# EAGLE design RedBoard-Artemis (EAGLE 9.4.2)
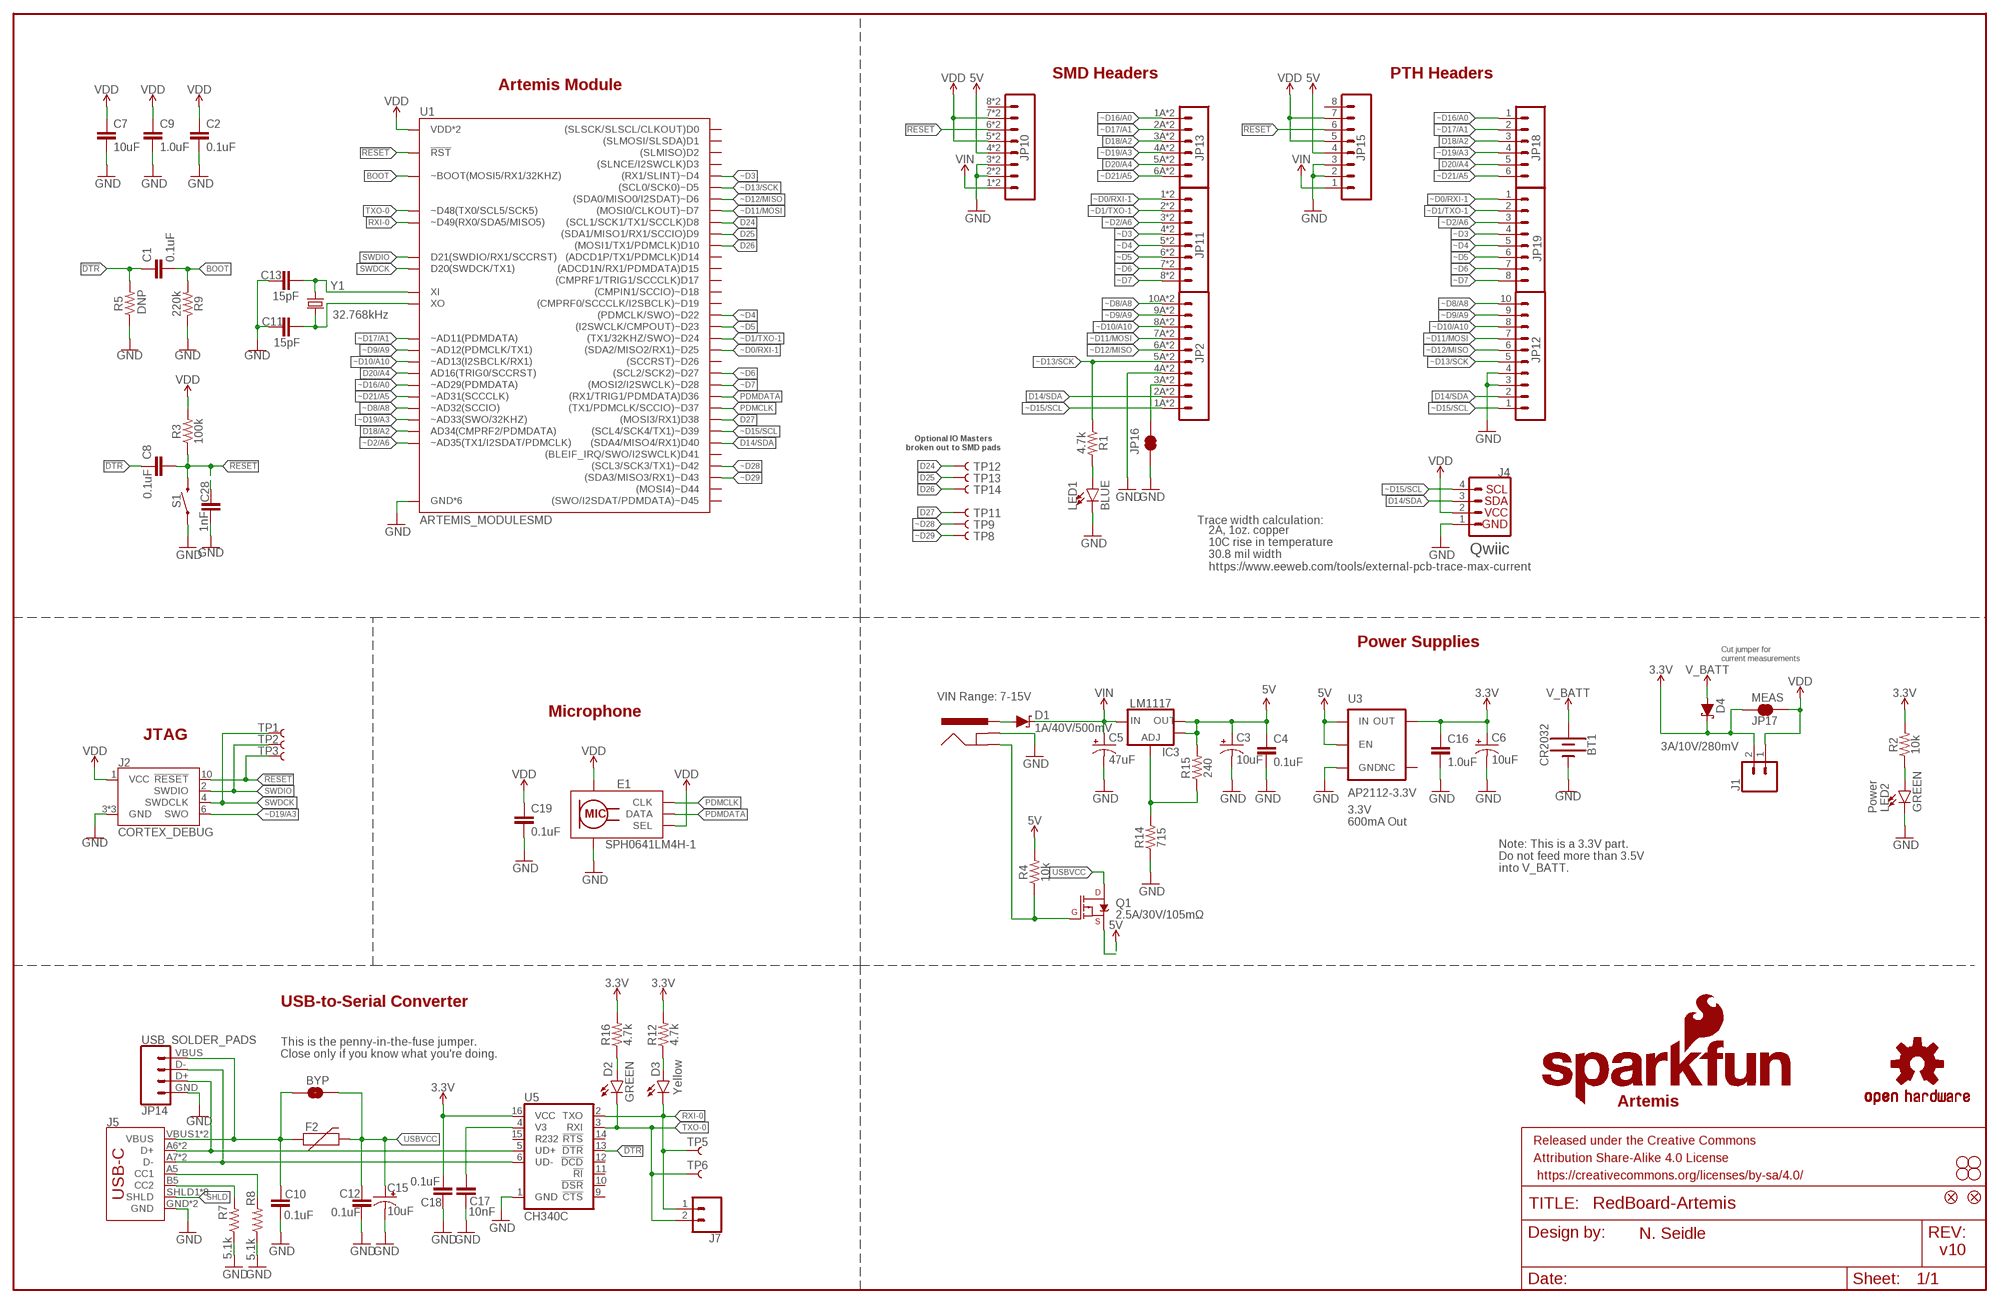
[diagram p0: schematic, sheet 1]

## Parts
BT1  CR2032  BATTERY-20MM_SMD_4LEGS_OVERPASTE  [BATTCON_20MM_4LEGS_OVERPASTE]
BYP  JUMPER-SMT_2_NO_SILK  [SMT-JUMPER_2_NO_SILK]
C1  0.1uF  0.1UF-0603-25V-5%  [0603]
C2  0.1uF  0.1UF-0603-25V-(+80/-20%)  [0603]
C3  10uF  10UF-POLAR-EIA3216-16V-10%(TANT)  [EIA3216]
C4  0.1uF  0.1UF-0603-25V-(+80/-20%)  [0603]
C5  47uF  47UF-POLAR-PANASONIC_D-35V-20%  [PANASONIC_D]
C6  10uF  10UF-POLAR-EIA3216-16V-10%(TANT)  [EIA3216]
C7  10uF  10UF-0603-6.3V-20%  [0603]
C8  0.1uF  0.1UF-0603-25V-5%  [0603]
C9  1.0uF  1.0UF-0603-16V-10%  [0603]
C10  0.1uF  0.1UF-0603-25V-(+80/-20%)  [0603]
C11  15pF  15PF-0603-50V-5%  [0603]
C12  0.1uF  0.1UF-0603-25V-(+80/-20%)  [0603]
C13  15pF  15PF-0603-50V-5%  [0603]
C15  10uF  10UF-POLAR-EIA3216-16V-10%(TANT)  [EIA3216]
C16  1.0uF  1.0UF-0603-16V-10%  [0603]
C17  10nF  10NF-0603-50V-10%  [0603]
C18  0.1uF  0.1UF-0603-25V-(+80/-20%)  [0603]
C19  0.1uF  0.1UF-0603-25V-(+80/-20%)  [0603]
C28  1nF  1.0NF/1000PF-0603-50V-10%  [0603]
D1  1A/40V/500mV  DIODE-SCHOTTKY-SS14  [SMA-DIODE]
D2  GREEN  LED-GREENLILYPAD  [LED-1206]
D3  Yellow  LED-YELLOWLILYPAD  [LED-1206]
D4  3A/10V/280mV  DIODE-SCHOTTKY-BAT60A  [SOD-323]
E1  SPH0641LM4H-1  SPH0641LM4H-1_MICROPHONE  [SPH0641LM4H-1_MICROPHONE]
F2  6V/2A  PPTC_6V2A  [1210]
FRAME3  FRAME-LEDGER  [CREATIVE_COMMONS]
IC3  LM1117  V_REG_LM1117ALT1  [SOT223-ALT1]
J1  CONN_021X02_NO_SILK  [1X02_NO_SILK]
J2  CORTEX_DEBUG  CORTEX_DEBUG_MINIMUM_PTH_NS  [2X5-PTH-1.27MM-NO_SILK]
J3  POWER_JACKTOE  [POWER_JACK_SMD_OVERPASTE_TOE]
J4  QWIIC_CONNECTORJS-1MM  [JST04_1MM_RA]
J5  USB-C  USB_C2-LAYER  [USB-C-16P]
J7  CONN_021X02_NO_SILK  [1X02_NO_SILK]
JP1  SFE_LOGO_NAME.1_INCH  [SFE_LOGO_NAME_.1]
JP2  M10SMD_COMBO  [1X10_SMD_COMBINED]
JP3  STAND-OFF  [STAND-OFF]
JP4  STAND-OFF  [STAND-OFF]
JP5  STAND-OFF  [STAND-OFF]
JP6  STAND-OFF  [STAND-OFF]
JP7  SFE_LOGO_FLAME.1_INCH  [SFE_LOGO_FLAME_.1]
JP8  FIDUCIAL1X2  [FIDUCIAL-1X2]
JP9  FIDUCIAL1X2  [FIDUCIAL-1X2]
JP10  CONN_08SMD-COMBO-FEMALE_NC  [1X08_SMD_COMBINED_NC]
JP11  JP11  CONN_08SMD-COMBO-FEMALE_NC  [1X08_SMD_COMBINED_NC]
JP12  M10NO_SILK  [1X10_NO_SILK]
JP13  M06SMD-STRAIGHT-COMBO  [1X06_SMD_STRAIGHT_COMBO]
JP14  USB_SOLDER_PADS  [USB-SOLDER-PADS]
JP15  M08NO_SILK  [1X08_NO_SILK@1]
JP16  JUMPER-SMT_2_NC_TRACE_SILK  [SMT-JUMPER_2_NC_TRACE_SILK]
JP17  MEAS  JUMPER-SMT_2_NC_TRACE_SILK  [SMT-JUMPER_2_NC_TRACE_SILK]
JP18  M06NO_SILK  [1X06_NO_SILK@1]
JP19  CONN_08NO_SILK_FEMALE_PTH  [1X08_NO_SILK]
LED1  BLUE  LED-BLUE1206  [LED-1206]
LED2  GREEN  LED-GREENLILYPAD  [LED-1206]
Q1  2.5A/30V/105mΩ  MOSFET_PCH-DMG2307L  [SOT23-3]
R1  4.7k  4.7KOHM-0603-1/10W-1%  [0603]
R2  10k  10KOHM-0603-1/10W-1%  [0603]
R3  100k  100KOHM-0603-1/10W-1%  [0603]
R4  10k  10KOHM-0603-1/10W-1%  [0603]
R5  RESISTOR0603  [0603]
R7  5.1k  5.1KOHM5.1KOHM-0603-1/10W-1%  [0603]
R8  5.1k  5.1KOHM5.1KOHM-0603-1/10W-1%  [0603]
R9  220k  220KOHM-0603-1/10W-1%  [0603]
R12  4.7k  4.7KOHM-0603-1/10W-1%  [0603]
R14  715  715OHM-0603-1/10W-1%  [0603]
R15  240  240OHM-0603-1/10W-1%  [0603]
R16  4.7k  4.7KOHM-0603-1/10W-1%  [0603]
S1  MOMENTARY-SWITCH-SPST-SMD-5.2-TALL-REDUNDANT  [TACTILE_SWITCH_SMD_5.2MM]
TP1  TEST-POINT3X5  [PAD.03X.05]
TP2  TEST-POINT3X5  [PAD.03X.05]
TP3  TEST-POINT3X5  [PAD.03X.05]
TP5  TEST-POINT3X5  [PAD.03X.05]
TP6  TEST-POINT3X5  [PAD.03X.05]
TP8  TEST-POINT3X5  [PAD.03X.05]
TP9  TEST-POINT3X5  [PAD.03X.05]
TP11  TEST-POINT3X5  [PAD.03X.05]
TP12  TEST-POINT3X5  [PAD.03X.05]
TP13  TEST-POINT3X5  [PAD.03X.05]
TP14  TEST-POINT3X5  [PAD.03X.05]
U1  ARTEMIS_MODULESMD  [ARTEMIS_FP]
U3  AP2112-3.3V  V_REG_AP2112K-3.3V  [SOT23-5]
U5  CH340C  [SO016]
U$16  OSHW-LOGOS  [OSHW-LOGO-S]
Y1  32.768kHz  CRYSTAL-32.768KHZSMD-3.2X1.5  [CRYSTAL-SMD-3.2X1.5MM]

## Nets
3.3V: C6.+ C16.1 C18.1 D4.C J1.2 JP17.1 R2.2 R12.2 R16.2 U3.5(OUT) U5.16(VCC)
5V [power]: C3.+ C4.1 IC3.2(OUT) IC3.4(OUT) JP10.4 JP10.4@2 JP15.4 Q1.2(S) R4.2 R15.2 U3.1(IN) U3.3(EN)
!DTR: C1.1 C8.1 R5.2 U5.13(!DTR)
!RESET: C8.2 C28.1 J2.10(!RESET) JP10.6 JP10.6@2 JP15.6 R3.1 S1.3 S1.4 TP3.P$1 U1.~RST(!RST)
BOOT: C1.2 R9.2 U1.BOOT(~BOOT(MOSI5/RX1/32KHZ))
CC1: J5.A5(CC1) R8.2
CC2: J5.B5(CC2) R7.2
D14/SDA: J4.3 JP2.2A JP2.2B JP12.2 U1.D40((SDA4/MISO4/RX1)D40)
D18/A2: JP13.3A JP13.3B JP18.3 U1.AD34(AD34(CMPRF2/PDMDATA))
D20/A4: JP13.5A JP13.5B JP18.5 U1.AD16(AD16(TRIG0/SCCRST))
D24: TP12.P$1 U1.D8((SCL1/SCK1/TX1/SCCLK)D8)
D25: TP13.P$1 U1.D9((SDA1/MISO1/RX1/SCCIO)D9)
D26: TP14.P$1 U1.D10((MOSI1/TX1/PDMCLK)D10)
D27: TP11.P$1 U1.D38((MOSI3/RX1)D38)
D+: J5.A6(D+) J5.B6(D+) JP14.D+ U5.5(UD+)
D-: J5.A7(D-) J5.B7(D-) JP14.D- U5.6(UD-)
GND: BT1.2(-) C2.1 C3.- C4.2 C5.- C6.- C7.2 C9.2 C10.2 C11.1 C12.2 C13.1 C15.- C16.2 C17.2 C18.2 C19.2 C28.2 E1.3(GND) E1.6(GND) E1.7(GND) E1.8(GND) J2.3(GND) J2.5(GND) J2.9(GND) J3.GND(GNDBREAK) J4.1 J5.GND J5.GND2(GND) JP2.4A JP2.4B JP10.2 JP10.2@2 JP10.3 JP10.3@2 JP12.3 JP12.4 JP14.GND JP15.2 JP15.3 JP16.1 LED1.C LED2.C R5.1 R7.1 R8.1 R9.1 R14.1 S1.1 S1.2 U1.GND@1(GND*6) U1.GND@22(GND*6) U1.GND@38(GND*6) U1.GND@39(GND*6) U1.GND@47(GND*6) U1.GND@59(GND*6) U3.2(GND) U5.1(GND)
INSERT: J3.P$4(GND) Q1.1(G) R4.1
N$1: LED1.A R1.2
N$2: LED2.A R2.1
N$5: D2.A R16.1
N$6: C17.1 U5.4(V3)
N$7: C11.2 U1.XO Y1.P$2
N$8: C13.2 U1.XI Y1.P$1
N$9: D3.A R12.1
N$10: JP2.3A JP2.3B JP16.2
N$15: IC3.1(ADJ) R14.2 R15.1
PDMCLK: E1.4(CLK) U1.~D37((TX1/PDMCLK/SCCIO)~D37)
PDMDATA: E1.1(DATA) U1.D36((RX1/TRIG1/PDMDATA)D36)
PWRIN [power]: D1.A J3.VIN0(PWR)
RXI-0: D3.C J7.1 TP5.P$1 U1.RXI-0(~D49(RX0/SDA5/MISO5)) U5.2(TXO)
SHLD: J5.SHLD1(SHLD) J5.SHLD2(SHLD) J5.SHLD3(SHLD) J5.SHLD4(SHLD) J5.SHLD5(SHLD) J5.SHLD6(SHLD) J5.SHLD7(SHLD) J5.SHLD8(SHLD)
SWDCK: J2.4(SWDCLK) TP1.P$1 U1.SWDCK(D20(SWDCK/TX1))
SWDIO: J2.2(SWDIO) TP2.P$1 U1.SWDIO(D21(SWDIO/RX1/SCCRST))
TXO-0: D2.C J7.2 TP6.P$1 U1.TXO-0(~D48(TX0/SCL5/SCK5)) U5.3(RXI)
USBVCC [power]: BYP.2 C12.1 C15.+ F2.2 Q1.3(D)
V_BATT: BT1.1(+) D4.A
VDD: C2.2 C7.1 C9.1 C19.1 E1.2(SEL) E1.5(VDD) J1.1 J2.1(VCC) J4.2 JP10.5 JP10.5@2 JP10.7 JP10.7@2 JP15.5 JP15.7 JP17.2 R3.2 U1.VDD@36(VDD*2) U1.VDD@37(VDD*2)
VIN [power]: C5.+ D1.C IC3.3(IN) JP10.1 JP10.1@2 JP15.1
VUSB [power]: BYP.1 C10.1 F2.1 J5.VBUS1(VBUS) J5.VBUS2(VBUS) JP14.VBUS
~D0/RXI-1: JP11.1 JP11.1@2 JP19.1 U1.~D25((SDA2/MISO2/RX1)~D25)
~D1/TXO-1: JP11.2 JP11.2@2 JP19.2 U1.~D24((TX1/32KHZ/SWO)~D24)
~D2/A6: JP11.3 JP11.3@2 JP19.3 U1.~AD35(~AD35(TX1/I2SDAT/PDMCLK))
~D3: JP11.4 JP11.4@2 JP19.4 U1.~D4((RX1/SLINT)~D4)
~D4: JP11.5 JP11.5@2 JP19.5 U1.~D22((PDMCLK/SWO)~D22)
~D5: JP11.6 JP11.6@2 JP19.6 U1.~D23((I2SWCLK/CMPOUT)~D23)
~D6: JP11.7 JP11.7@2 JP19.7 U1.~D27((SCL2/SCK2)~D27)
~D7: JP11.8 JP11.8@2 JP19.8 U1.~D28((MOSI2/I2SWCLK)~D28)
~D8/A8: JP2.10A JP2.10B JP12.10 U1.~AD32(~AD32(SCCIO))
~D9/A9: JP2.9A JP2.9B JP12.9 U1.~AD12(~AD12(PDMCLK/TX1))
~D10/A10: JP2.8A JP2.8B JP12.8 U1.~AD13(~AD13(I2SBCLK/RX1))
~D11/MOSI: JP2.7A JP2.7B JP12.7 U1.D7((MOSI0/CLKOUT)~D7)
~D12/MISO: JP2.6A JP2.6B JP12.6 U1.~D6((SDA0/MISO0/I2SDAT)~D6)
~D13/SCK: JP2.5A JP2.5B JP12.5 R1.1 U1.~D5((SCL0/SCK0)~D5)
~D15/SCL: J4.4 JP2.1A JP2.1B JP12.1 U1.~D39((SCL4/SCK4/TX1)~D39)
~D16/A0: JP13.1A JP13.1B JP18.1 U1.~AD29(~AD29(PDMDATA))
~D17/A1: JP13.2A JP13.2B JP18.2 U1.~AD11(~AD11(PDMDATA))
~D19/A3: J2.6(SWO) JP13.4A JP13.4B JP18.4 U1.~AD33/SWO(~AD33(SWO/32KHZ))
~D21/A5: JP13.6A JP13.6B JP18.6 U1.~AD31(~AD31(SCCCLK))
~D28: TP9.P$1 U1.~D42((SCL3/SCK3/TX1)~D42)
~D29: TP8.P$1 U1.~D43((SDA3/MISO3/RX1)~D43)
Unconnected: JP10.8 JP10.8@2 JP15.8 U1.D0((SLSCK/SLSCL/CLKOUT)D0) U1.D1((SLMOSI/SLSDA)D1) U1.D2((SLMISO)D2) U1.D3((SLNCE/I2SWCLK)D3) U1.D14((ADCD1P/TX1/PDMCLK)D14) U1.D15((ADCD1N/RX1/PDMDATA)D15) U1.D17((CMPRF1/TRIG1/SCCCLK)D17) U1.D41((BLEIF_IRQ/SWO/I2SWCLK)D41) U1.~D18((CMPIN1/SCCIO)~D18) U1.~D19((CMPRF0/SCCCLK/I2SBCLK)~D19) U1.~D26((SCCRST)~D26) U1.~D44((MOSI4)~D44) U1.~D45((SWO/I2SDAT/PDMDATA)~D45) U3.4(NC) U5.9(!CTS) U5.10(!DSR) U5.11(!RI) U5.12(!DCD) U5.14(!RTS) U5.15(R232)

## Notes on the sheet
- SMD Headers | PTH Headers
- Artemis Module
- DNP
- Optional IO Masters
  broken out to SMD pads
- Trace width calculation:
- Qwiic
- 2A, 1oz. copper
  10C rise in temperature
  30.8 mil width
  https://www.eeweb.com/tools/external-pcb-trace-max-current
- Power Supplies
- Cut jumper for
  current measurements
- VIN Range: 7-15V
- Microphone
- JTAG
- Power
- 3.3V
  600mA Out
- Note: This is a 3.3V part.
  Do not feed more than 3.5V
  into V_BATT.
- USB-to-Serial Converter
- This is the penny-in-the-fuse jumper.
  Close only if you know what you're doing.
- Artemis
- N. Seidle
- v10

## Library data of the parts
BT1 = SparkFun-Batteries:BATTERY: Battery - Single Cell A variety of battery chemistries, sizes, and footprints. Device List: 20MM_PTH - Coin Cell Battery Holder - 20mm (PTH) <https://www.sparkfun.com/products/783> 20MM_PTH_KIT- Coin Cell battery Holder - 20 mm (PTH) <http://www.sparkfun.com/products/783>kit version with special mask 6.8MM_PTH - Coin Cell Battery Holder - 6.8MM(SMD) <https://www.digikey.com/product-detail/en/seiko-instruments/MS621FE-FL11E/728-1057-ND/1889208?WT.srch=1&gclid=CNOQ5a6LzdQCFZS2wAodXCkE0g> 12MM_SMD - Coin Cell Battery Holder - 12mm (SMD) <https://www.sparkfun.com/products/10592> 12MM_PTH - Coin Cell Battery Holder - 12mm (PTH) <https://www.sparkfun.com/products/7948> 20MM_SMD - 20mm Coin Cell Battery Holder (SMD) (2 legs) Used on the Big Time Watch Kit <https://www.sparkfun.com/products/11734> 20MM_SMD_4LEGS - Coin Cell Battery Holder - 20mm (SMD) <https://www.sparkfun.com/products/11892> 20MM_SMD_4LEGS_OVERPASTE - Coin Cell Battery Holder - 20mm (SMD) <https://www.sparkfun.com/products/11892> (Over-paste on the legs) 24.5MM_PTH - Coin Cell Battery Holder - 24.5mm (PTH) <https://www.sparkfun.com/products/8863> 9V - 9V Battery Holder - PC Mount Used on the SparkFun SparkPunk Sound Kit <https://www.sparkfun.com/products/11177> and SparkFun SparkPunk Sequencer Kit <https://www.sparkfun.com/products/12707> 18650 - Battery Holder - 18650 (PTH) <https://www.sparkfun.com/products/13113> AA - Battery Holder - 1xAA (PTH) <https://www.sparkfun.com/products/7949> AAA - Battery Holder - 1xAAA (PTH) <https://www.sparkfun.com/products/12718> AA_KIT - Battery Holder - 1xAA (PTH) <https://www.sparkfun.com/products/7949> Special kit package - pads only have exposed copper on one side of the board. AAA_KIT - Battery Holder - 1xAAA (PTH) <https://www.sparkfun.com/products/12718> Special kit package - pads only have exposed copper on one side of the board.; PROD_ID: PRT-11892; SF_SKU: BATT-10373
BYP = SparkFun-Jumpers:JUMPER-SMT_2_NO: Normally open jumper This jumper has two pads in close proximity to each other. Apply solder to close the connection. Round pads are easier to solder for beginners, but are a lot larger. SparkFun Product that uses the round pads: SparkFun EL Sequencer <https://www.sparkfun.com/products/12781>
C1 C8 = SparkFun-Capacitors:0.1UF: 0.1µF ceramic capacitors A capacitor is a passive two-terminal electrical component used to store electrical energy temporarily in an electric field.; PROD_ID: CAP-08604
C2 C4 C10 C12 C18 C19 = SparkFun-Capacitors:0.1UF: 0.1µF ceramic capacitors A capacitor is a passive two-terminal electrical component used to store electrical energy temporarily in an electric field.; PROD_ID: CAP-00810
C3 C6 C15 = SparkFun-Capacitors:10UF-POLAR: 10.0µF polarized capacitors A capacitor is a passive two-terminal electrical component used to store electrical energy temporarily in an electric field.; PROD_ID: CAP-00811
C5 = SparkFun-Capacitors:47UF-POLAR: 47µF polarized capacitors A capacitor is a passive two-terminal electrical component used to store electrical energy temporarily in an electric field.; PROD_ID: CAP-08478
C7 = SparkFun-Capacitors:10UF: 10.0µF ceramic capacitors A capacitor is a passive two-terminal electrical component used to store electrical energy temporarily in an electric field.; PROD_ID: CAP-11015
C9 C16 = SparkFun-Capacitors:1.0UF: 1µF ceramic capacitors A capacitor is a passive two-terminal electrical component used to store electrical energy temporarily in an electric field.; PROD_ID: CAP-00868
C11 C13 = SparkFun-Capacitors:15PF: 15pF ceramic capacitors A capacitor is a passive two-terminal electrical component used to store electrical energy temporarily in an electric field.; PROD_ID: CAP-07881
C17 = SparkFun-Capacitors:10NF: 0.01uF/10nF/10,000pF ceramic capacitors A capacitor is a passive two-terminal electrical component used to store electrical energy temporarily in an electric field. CAP-09321; PROD_ID: CAP-00867
C28 = SparkFun-Capacitors:1.0NF/1000PF: 1nF/1,000pF ceramic capacitors A capacitor is a passive two-terminal electrical component used to store electrical energy temporarily in an electric field.; PROD_ID: CAP-07886
D1 = SparkFun-DiscreteSemi:DIODE-SCHOTTKY: Schottky diode A Schottky diode is a semiconductor diode which has a low forward voltage drop and a very fast switching action.; PROD_ID: DIO-08053
D2 LED2 = SparkFun-LED:LED-GREEN: Green SMD LED Used in manufacturing of various products at SparkFun Packages: 0603 - SMD 0603 package [Product Link] <http://www.futureelectronics.com/en/technologies/semiconductors/optoelectronics/leds/Pages/9894312-LTST-C190GKT.aspx?CrossPart=HSMG-C190&IM=0> LilyPad 1206 - SMD1206 LilyPad package [Product Link] <http://www.futureelectronics.com/en/Technologies/Product.aspx?ProductID=IN150NGHARVATEKCORPORATION2049943&IM=0> 1206 - SMD1206 package [Product Link] <http://www.futureelectronics.com/en/technologies/semiconductors/optoelectronics/leds/Pages/8315665-LTST-C150KGKT.aspx?IM=0> 1206 Bottom Mount -SMD 1206 Bottom Mount [Product Link] <http://www.digikey.com/product-detail/en/lite-on-inc/LTST-C230KGKT/160-1456-1-ND/386854> SparkFun Products: Pro Mini 328 -5V <https://www.sparkfun.com/products/821> RedBoard <https://www.sparkfun.com/products/12757> MP3 Trigger <https://www.sparkfun.com/products/13720> Makey Makey <https://www.sparkfun.com/products/11076>; PROD_ID: DIO-09910
D3 = SparkFun-LED:LED-YELLOW: Yellow SMD LED Used in manufacturing several products at SparkFun. Packages: 0603 - SMD 0603 package[Product Link] <http://www.kingbrightusa.com/product.asp?catalog_name=LED&product_id=APT1608SYCK> 0603 -SMART - SMART SMD 0603 package (more efficient/more expensive) [Product Link] <http://www.osram-os.com/osram_os/en/products/product-catalog/led-light-emitting-diodes/smartled-0603/ly-l29k/index.jsp> LilyPad - SMD1206 package[Product Datasheet] <https://www.sparkfun.com/datasheets/DevTools/LilyPad/Q150YUS4.pdf> SparkFun Products: Blynk Board <https://www.sparkfun.com/products/13794> IOIO-OTG <https://www.sparkfun.com/products/13613> XBee Explorer Serial <https://www.sparkfun.com/products/13225>; PROD_ID: DIO-09909
D4 = SparkFun-DiscreteSemi:DIODE-SCHOTTKY: Schottky diode A Schottky diode is a semiconductor diode which has a low forward voltage drop and a very fast switching action.; PROD_ID: DIO-14072
E1 = SparkFun-Sensors:SPH0641LM4H-1_MICROPHONE: SPH0641LM4H-1 Microphone A miniature, high-performance, low power, bottom port silicon digital microphone with a single bit PDM output.; PROD_ID: IC-14361
F2 = SparkFun-Fuses:PPTC: Resettable Fuse PPTC Resettable Fuse. Really a sort of resistor with a polymeric positive temperature coefficient whose resistance increases dramatically with an increase in temperature. When heated by the power passing through the resistance rises causing the current to be limited, protecting the circuit. This is achieved by the transition of the polymer from a crystalline to an amorphous state where the conductive carbon separates breaking the conductive pathways found in the cool crystalline structure. When a PPTC cools back down it resumes conducting letting the circuit turn back on. SparkFun Products: SparkFun RedBoard - Programmed with Arduino <https://www.sparkfun.com/products/12757> Pro Micro - 5V/16MHz <https://www.sparkfun.com/products/12640> Arduino Pro 328 - 5V/16MHz <https://www.sparkfun.com/products/10915> MP3 Trigger <https://www.sparkfun.com/products/13720>; PROD_ID: RES-14313
FRAME3 = SparkFun-Aesthetics:FRAME-LEDGER: Schematic Frame - Ledger Standard 11x14 US Ledger frame
IC3 = Testing:V_REG_LM1117: Voltage Regulator LM1117 Standard adjustable voltage regulator but in SMD form. Spark Fun Electronics SKU : COM-00595; PROD_ID: VREG-08170
J1 J7 = SparkFun-Connectors:CONN_02: Multi connection point. Often used as Generic Header-pin footprint for 0.1 inch spaced/style header connections On any of the 0.1 inch spaced packages, you can populate with these: Break Away Headers - Straight <https://www.sparkfun.com/products/116> (PRT-00116) Break Away Male Headers - Right Angle <https://www.sparkfun.com/products/553> (PRT-00553) Female Headers <https://www.sparkfun.com/products/115> (PRT-00115) Break Away Headers - Machine Pin <https://www.sparkfun.com/products/117> (PRT-00117) Break Away Female Headers - Swiss Machine Pin <https://www.sparkfun.com/products/743> (PRT-00743) For SCREWTERMINALS and SPRING TERMINALS visit here: Screw Terimnals on SparkFun.com <https://www.sparkfun.com/search/results?term=Screw+Terminals> (5mm/3.5mm/2.54mm spacing) This device is also useful as a general connection point to wire up your design to another part of your project. Our various solder wires solder well into these plated through hole pads. Hook-Up Wire - Assortment (Stranded, 22 AWG) <https://www.sparkfun.com/products/11375> (PRT-11375) Hook-Up Wire - Assortment (Solid Core, 22 AWG) <https://www.sparkfun.com/products/11367> (PRT-11367) View the entire wire category on our website here <https://www.sparkfun.com/categories/141> Special notes: Molex polarized connector foot print use with: PRT-08233 with associated crimp pins and housings. 2.54_SCREWTERM for use with PRT-10571. 3.5mm Screw Terminal footprints for PRT-08084 5mm Screw Terminal footprints for use with PRT-08432
J2 = SparkFun-Connectors:CORTEX_DEBUG_MINIMUM: Cortex Debug Connector - 10 pin Supports JTAG debug, Serial Wire debug, and Serial Wire Viewer. PTH and SMD connector options available. General Connector Information <http://infocenter.arm.com/help/topic/com.arm.doc.faqs/attached/13634/cortex_debug_connectors.pdf> Products: PTH Connector <http://www.digikey.com/product-detail/en/cnc-tech/3220-10-0100-00/1175-1627-ND/3883661> -via Digi-Key SparkFun PSoc <https://www.sparkfun.com/products/13229> SparkFun T <https://www.sparkfun.com/products/13810>
J3 = SparkFun-Connectors:POWER_JACK: Power Jack Connector This is the standard 5.5mm barrel jack for power. The PTH is the most common, proven, reliable, footprint. The Slot footprint only works if the mill layer is transmitted to the PCB fab house so be warned. Here are the connectors we sell at SparkFun: DC Barrel Power Jack/Connector <https://www.sparkfun.com/products/119> (PRT-00119) DC Barrel Power Jack/Connector (SMD) <https://www.sparkfun.com/products/12748> (PRT-12748) DC Barrel Jack Adapter - Breadboard Compatible <https://www.sparkfun.com/products/10811> (PRT-10811) It is used on this SparkFun product (and many, many others): SparkFun RedBoard - Programmed with Arduino <https://www.sparkfun.com/products/12757> (DEV-12757) Also, if you need a mating power supply or connector, please check these out: Wall Adapter Power Supply - 9VDC 650mA <https://www.sparkfun.com/products/298> (TOL-00298) DC Barrel Jack Adapter - Male <https://www.sparkfun.com/products/10287> (PRT-10287); PROD_ID: CONN-08106; SF_ID: PRT-12748
J4 = SparkFun-Connectors:QWIIC_CONNECTOR: SparkFun I2C Standard Qwiic Connector An SMD 1mm pitch JST connector makes it easy and quick (get it? Qwiic?) to connect I2C devices to each other. The Qwiic system <http://www.sparkfun.com/qwiic> enables fast and solderless connection between popular platforms and various sensors and actuators. We carry 200mm <https://www.sparkfun.com/products/14204>, 100mm <https://www.sparkfun.com/products/14205>, 50mm <https://www.sparkfun.com/products/14206>, and breadboard friendly <https://www.sparkfun.com/products/14207> Qwiic cables. We also offer 10 pcs strips <https://www.sparkfun.com/products/14323> the SMD connectors.; PROD_ID: CONN-13694
J5 = SparkFun-Connectors:USB_C: USB Type C 16Pin Connector Super Speed pins not available on the 16-pin purely SMD connector so this part is best for USB 2.0 implementations. D1 and D2 are tied together enabling D+/- no matter which way the cable is plugged into the connector. The two channel configuration pins (CC1/2) are exposed. These are normally connected to ground via 5.1k resistors but can be reconfigured for high current/high power applications.; PROD_ID: CONN-14122
JP1 = SparkFun-Aesthetics:SFE_LOGO_NAME: SparkFun Font Logo This is the SparkFun name logo. The logo on the schematic will always be the same size; the package variant is the height of the flame part of the logo (or the height the flame would be, if it were drawn). Default layer for the logo on the board is tSilk.
JP2 JP12 = SparkFun-Connectors:M10: Header 10 Standard 10-pin 0.1" header. Use with straight break away headers (SKU : PRT-00116), right angle break away headers (PRT-00553), swiss pins (PRT-00743), machine pins (PRT-00117), and female headers (PRT-00115).; PROD_ID: CONN-11219
JP3-JP6 = SparkFun:STAND-OFF: Stand Off This is the mechanical footprint for a #4 phillips button head screw. Use the keepout ring to avoid running the screw head into surrounding components. SKU : PRT-00447
JP7 = SparkFun-Aesthetics:SFE_LOGO_FLAME: SparkFun Flame Logo This is the SparkFun flame logo. The logo on the schematic will always be the same size; the package variant is the height of the flame. Default layer for the logo on the board is tSilk.
JP8 JP9 = SparkFun:FIDUCIAL: Fiducial Alignment Points Various fiducial points for machine vision alignment.
JP10 JP11 = SparkFun-Connectors:CONN_08: Multi connection point. Often used as Generic Header-pin footprint for 0.1 inch spaced/style header connections On any of the 0.1 inch spaced packages, you can populate with these: Break Away Headers - Straight <https://www.sparkfun.com/products/116> (PRT-00116) Break Away Male Headers - Right Angle <https://www.sparkfun.com/products/553> (PRT-00553) Female Headers <https://www.sparkfun.com/products/115> (PRT-00115) Break Away Headers - Machine Pin <https://www.sparkfun.com/products/117> (PRT-00117) Break Away Female Headers - Swiss Machine Pin <https://www.sparkfun.com/products/743> (PRT-00743) Arduino Stackable Header - 8 Pin <https://www.sparkfun.com/products/9279> (PRT-09279) For SCREWTERMINALS and SPRING TERMINALS visit here: Screw Terimnals on SparkFun.com <https://www.sparkfun.com/search/results?term=Screw+Terminals> (5mm/3.5mm/2.54mm spacing) This device is also useful as a general connection point to wire up your design to another part of your project. Our various solder wires solder well into these plated through hole pads. Hook-Up Wire - Assortment (Stranded, 22 AWG) <https://www.sparkfun.com/products/11375> (PRT-11375) Hook-Up Wire - Assortment (Solid Core, 22 AWG) <https://www.sparkfun.com/products/11367> (PRT-11367) View the entire wire category on our website here <https://www.sparkfun.com/categories/141> Special notes: Molex polarized connector foot print use with SKU : PRT-08231 with associated crimp pins and housings. 1MM SMD Version SKU: PRT-10208 NOTES ON THE VARIANTS LOCK and LOCK_LONGPADS... This footprint was designed to help hold the alignment of a through-hole component (i.e. 6-pin header) while soldering it into place. You may notice that each hole has been shifted either up or down by 0.005 of an inch from it's more standard position (which is a perfectly straight line). This slight alteration caused the pins (the squares in the middle) to touch the edges of the holes. Because they are alternating, it causes a "brace" to hold the component in place. 0.005 has proven to be the perfect amount of "off-center" position when using our standard breakaway headers. Although looks a little odd when you look at the bare footprint, once you have a header in there, the alteration is very hard to notice. Also,if you push a header all the way into place, it is covered up entirely on the bottom side.; PROD_ID: CONN-10204
JP13 JP18 = SparkFun-Connectors:M06: Header 6 Standard 6-pin 0.1" header. Use with straight break away headers (SKU : PRT-00116), right angle break away headers (PRT-00553), swiss pins (PRT-00743), machine pins (PRT-00117), and female headers (PRT-00115). Molex polarized connector foot print use with SKU : PRT-08094 with associated crimp pins and housings. NOTES ON THE VARIANTS LOCK and LOCK_LONGPADS... This footprint was designed to help hold the alignment of a through-hole component (i.e. 6-pin header) while soldering it into place. You may notice that each hole has been shifted either up or down by 0.005 of an inch from it's more standard position (which is a perfectly straight line). This slight alteration caused the pins (the squares in the middle) to touch the edges of the holes. Because they are alternating, it causes a "brace" to hold the component in place. 0.005 has proven to be the perfect amount of "off-center" position when using our standard breakaway headers. Although looks a little odd when you look at the bare footprint, once you have a header in there, the alteration is very hard to notice. Also,if you push a header all the way into place, it is covered up entirely on the bottom side. This idea of altering the position of holes to aid alignment will be further integrated into the Sparkfun Library for other footprints. It can help hold any component with 3 or more connection pins.; PROD_ID: CONN-10203
JP14 = SparkFun-Connectors:USB_SOLDER_PADS: Solder pad access to USB pins. Helpful to expose on PCBs so user can attach external USB connector if necessary.
JP15 = SparkFun-Connectors:M08: Header 8 Standard 8-pin 0.1" header. Use with straight break away headers (SKU : PRT-00116), right angle break away headers (PRT-00553), swiss pins (PRT-00743), machine pins (PRT-00117), and female headers (PRT-00115).; PROD_ID: CONN-10204
JP16 JP17 = SparkFun-Jumpers:JUMPER-SMT_2_NC_TRACE: Normally closed trace jumper This jumper has a trace between two pads so it's normally closed (NC). Use a razor knife to open the connection. For best results follow the IPC guidelines for cutting traces: Cutout at least 0.063 mm (0.005 in). Remove all loose material to clean up the cut area. Seal the cut with an approved epoxy. Reapply solder to reclose the connection.
JP19 = SparkFun-Connectors:CONN_08: Multi connection point. Often used as Generic Header-pin footprint for 0.1 inch spaced/style header connections On any of the 0.1 inch spaced packages, you can populate with these: Break Away Headers - Straight <https://www.sparkfun.com/products/116> (PRT-00116) Break Away Male Headers - Right Angle <https://www.sparkfun.com/products/553> (PRT-00553) Female Headers <https://www.sparkfun.com/products/115> (PRT-00115) Break Away Headers - Machine Pin <https://www.sparkfun.com/products/117> (PRT-00117) Break Away Female Headers - Swiss Machine Pin <https://www.sparkfun.com/products/743> (PRT-00743) Arduino Stackable Header - 8 Pin <https://www.sparkfun.com/products/9279> (PRT-09279) For SCREWTERMINALS and SPRING TERMINALS visit here: Screw Terimnals on SparkFun.com <https://www.sparkfun.com/search/results?term=Screw+Terminals> (5mm/3.5mm/2.54mm spacing) This device is also useful as a general connection point to wire up your design to another part of your project. Our various solder wires solder well into these plated through hole pads. Hook-Up Wire - Assortment (Stranded, 22 AWG) <https://www.sparkfun.com/products/11375> (PRT-11375) Hook-Up Wire - Assortment (Solid Core, 22 AWG) <https://www.sparkfun.com/products/11367> (PRT-11367) View the entire wire category on our website here <https://www.sparkfun.com/categories/141> Special notes: Molex polarized connector foot print use with SKU : PRT-08231 with associated crimp pins and housings. 1MM SMD Version SKU: PRT-10208 NOTES ON THE VARIANTS LOCK and LOCK_LONGPADS... This footprint was designed to help hold the alignment of a through-hole component (i.e. 6-pin header) while soldering it into place. You may notice that each hole has been shifted either up or down by 0.005 of an inch from it's more standard position (which is a perfectly straight line). This slight alteration caused the pins (the squares in the middle) to touch the edges of the holes. Because they are alternating, it causes a "brace" to hold the component in place. 0.005 has proven to be the perfect amount of "off-center" position when using our standard breakaway headers. Although looks a little odd when you look at the bare footprint, once you have a header in there, the alteration is very hard to notice. Also,if you push a header all the way into place, it is covered up entirely on the bottom side.; PROD_ID: CONN-08438
LED1 = SparkFun-LED:LED-BLUE: Blue SMD LED Used in manufacturing of various products at SparkFun Packages: 0603 - SMD 0603 package [Product Link] <http://www.digikey.com/product-detail/en/SMLE12BC7TT86/511-1589-2-ND/1641808> 1206 - SMD1206 package [Product Link] <http://www.digikey.com/product-detail/en/lite-on-inc/LTST-C150TBKT/160-1643-1-ND/573584> SparkFun Products: ESP8266 Thing-Dev Board <https://www.sparkfun.com/products/13711> RedBoard <https://www.sparkfun.com/products/12757>; PROD_ID: DIO-09911
Q1 = SparkFun-DiscreteSemi:MOSFET_PCH: P-channel MOSFETs Voltage controlled devices that allow control of high current outputs. SparkFun Products: SparkFun ESP32 Thing <https://www.sparkfun.com/products/13907> SparkFun ESP8266 Thing <https://www.sparkfun.com/products/13231> SparkFun Pi Servo HAT V2 <https://www.sparkfun.com/products/15316> DMG2305UX-7 (20V/4.2A/SOT23-3); PROD_ID: TRANS-11308
R1 R12 R16 = SparkFun-Resistors:4.7KOHM: 4.7kΩ resistor A resistor is a passive two-terminal electrical component that implements electrical resistance as a circuit element. Resistors act to reduce current flow, and, at the same time, act to lower voltage levels within circuits. - Wikipedia; PROD_ID: RES-07857
R2 R4 = SparkFun-Resistors:10KOHM: 10kΩ resistor A resistor is a passive two-terminal electrical component that implements electrical resistance as a circuit element. Resistors act to reduce current flow, and, at the same time, act to lower voltage levels within circuits. - Wikipedia; PROD_ID: RES-00824
R3 = SparkFun-Resistors:100KOHM: 100kΩ resistor A resistor is a passive two-terminal electrical component that implements electrical resistance as a circuit element. Resistors act to reduce current flow, and, at the same time, act to lower voltage levels within circuits. - Wikipedia; PROD_ID: RES-07828
R5 = SparkFun-Resistors:RESISTOR: Generic Resistor Package
R7 R8 = SparkFun-Resistors:5.1KOHM; PROD_ID: RES-12083
R9 = SparkFun-Resistors:220KOHM: 220kΩ resistor A resistor is a passive two-terminal electrical component that implements electrical resistance as a circuit element. Resistors act to reduce current flow, and, at the same time, act to lower voltage levels within circuits. - Wikipedia; PROD_ID: RES-08969
R14 = SparkFun-Resistors:715OHM: 715Ω resistor A resistor is a passive two-terminal electrical component that implements electrical resistance as a circuit element. Resistors act to reduce current flow, and, at the same time, act to lower voltage levels within circuits. - Wikipedia; PROD_ID: RES-07850
R15 = SparkFun-Resistors:240OHM: 240Ω resistor A resistor is a passive two-terminal electrical component that implements electrical resistance as a circuit element. Resistors act to reduce current flow, and, at the same time, act to lower voltage levels within circuits. - Wikipedia; PROD_ID: RES-07849
S1 = SparkFun-Switches:MOMENTARY-SWITCH-SPST: Momentary Switch (Pushbutton) - SPST Normally-open (NO) SPST momentary switches (buttons, pushbuttons). Variants PTH-12MM - 12mm square, through-hole Momentary Pushbutton Switch - 12mm Square <https://www.sparkfun.com/products/9190> (COM-09190) PTH-6.0MM, PTH-6.0MM-KIT - 6.0mm square, through-hole Mini Pushbutton Switch <https://www.sparkfun.com/products/97> (COM-00097) KIT package intended for soldering kit's - only one side of pads' copper is exposed. PTH-RIGHT-ANGLE-KIT - Right-angle, through-hole Right Angle Tactile Button <https://www.sparkfun.com/products/10791> - Used on SparkFun BigTime Watch Kit <https://www.sparkfun.com/products/11734> SMD-12MM - 12mm square, surface-mount Tactile Button - SMD (12mm) <https://www.sparkfun.com/products/12993> (COM-12993) Used on SparkFun PicoBoard <https://www.sparkfun.com/products/11888> SMD-4.5MM - 4.5mm Square Trackball Switch Used on SparkFun Blackberry Trackballer Breakout <https://www.sparkfun.com/products/13169> SMD-4.6MMX2.8MM - 4.60mm x 2.80mm, surface mount Used on SparkFun SAMD21 Mini Breakout <https://www.sparkfun.com/products/13664> SMD-5.2MM, SMD-5.2-REDUNDANT - 5.2mm square, surface-mount Mini Pushbutton Switch - SMD <https://www.sparkfun.com/products/8720> (COM-08720) Used on Arduino Pro Mini <https://www.sparkfun.com/products/11114> REDUNDANT package connects both switch circuits together SMD-6.0X3.5MM - 6.0 x 3.5mm, surface mount Momentary Reset Switch SMD <https://www.sparkfun.com/products/8229> (COM-08229) SMD-6.2MM-TALL - 6.2mm square, surface mount Tactile Button - SMD (6mm) <https://www.sparkfun.com/products/12992> Used on SparkFun Digital Sandbox <https://www.sparkfun.com/products/12651> SMD-RIGHT-ANGLE - Right-angle, surface mount Used on SparkFun Block for Intel® Edison - Arduino <https://www.sparkfun.com/products/13036>; PROD_ID: SWCH-14139
TP1-TP3 TP5 TP6 TP8 TP9 TP11-TP14 = SparkFun-Connectors:TEST-POINT: SparkFun Test Points Bare copper test points for troubleshooting or In-Circuit-Testing. These are used by our Production team for verifying production board runs using pogo-pins on test beds. SparkFun Products: SparkFun LSM9DS1 Breakout <https://www.sparkfun.com/products/13284> SparkFun PSOC <https://www.sparkfun.com/products/13714> SparkFun Load Cell Amplifier <https://www.sparkfun.com/products/13879>
U1 = SparkFun-IC-Microcontroller:ARTEMIS_MODULE: Description: The Artemis Module from SparkFun is a Cortex-M4F with BLE 5.0 running up to 96MHz and with as low power as 6uA per MHz (less than 5mW). This is the world's first module to bridge the market between hobbyists and consumer products. We've packaged all the power of a modern microcontroller into a module that is both extremely easy to use but is mass-market ready. The flexibility of the Artemis module starts with our [Arduino core](https://github.com/sparkfun/Arduino_Apollo3). You can program and use the Artemis module just like you would an Uno or any other Arduino. Time to first blink is just 5 minutes away! We built the core from the ground up, making it fast and as light weight as possible.; PROD_ID: SUB-14415
U3 = SparkFun-PowerIC:V_REG_AP2112: AP2112 - 600mA CMOS LDO Regulator w/ Enable The AP2112 is CMOS process low dropout linear regulator with enable function, the regulator delivers a guaranteed 600mA (min.) continuous load current. Features Output Voltage Accuracy: ±1.5% Output Current: 600mA (Min.) Foldback Short Current Protection: 50mA Enable Function to Turn ON/OFF VOUT Low Dropout Voltage (3.3V): 250mV (Typ.) @IOUT=600mA Excellent Load Regulation: 0.2%/A (Typ.) Excellent Line Regulation: 0.02%/V (Typ.) Low Quiescent Current: 55μA (Typ.) Low Standby Current: 0.01μA (Typ.) Low Output Noise: 50μVRMS PSRR: 100Hz -65dB, 1kHz -65dB OTSD Protection Stable with 1.0μF Flexible Cap: Ceramic, Tantalum and Aluminum Electrolytic Operation Temperature Range: -40°C to 85°C ESD: MM 400V, HBM 4000V; PROD_ID: VREG-12457; VALUE: 3.3V
U5 = SparkFun-IC-Comms:CH340C; PROD_ID: IC-14038
U$16 = SparkFun-Aesthetics:OSHW-LOGO: Open-Source Hardware (OSHW) Logo This logo indicates the piece of hardware it is found on incorporates a OSHW license and/or adheres to the definition of open source hardware found here: http://freedomdefined.org/OSHW
Y1 = SparkFun-Clocks:CRYSTAL-32.768KHZ: 32.768kHz Crystal Frequency: 32.768kHz Frequency Stability: ±20ppm Load Capacitance: 12.5pF (PTH-2X6 & SMD-3.2X1.5), 6pF (SMD-2X6) SparkFun Products: SparkFun BigTime Watch Kit <https://www.sparkfun.com/products/11734> SparkFun nRF52832 Breakout <https://www.sparkfun.com/products/13990> SparkFun Real Time Clock Module <https://www.sparkfun.com/products/12708>; PROD_ID: XTAL-13062

## Net classes
0 default: width 0 mm, drill 0 mm
1 power: width 0.762 mm

## Board
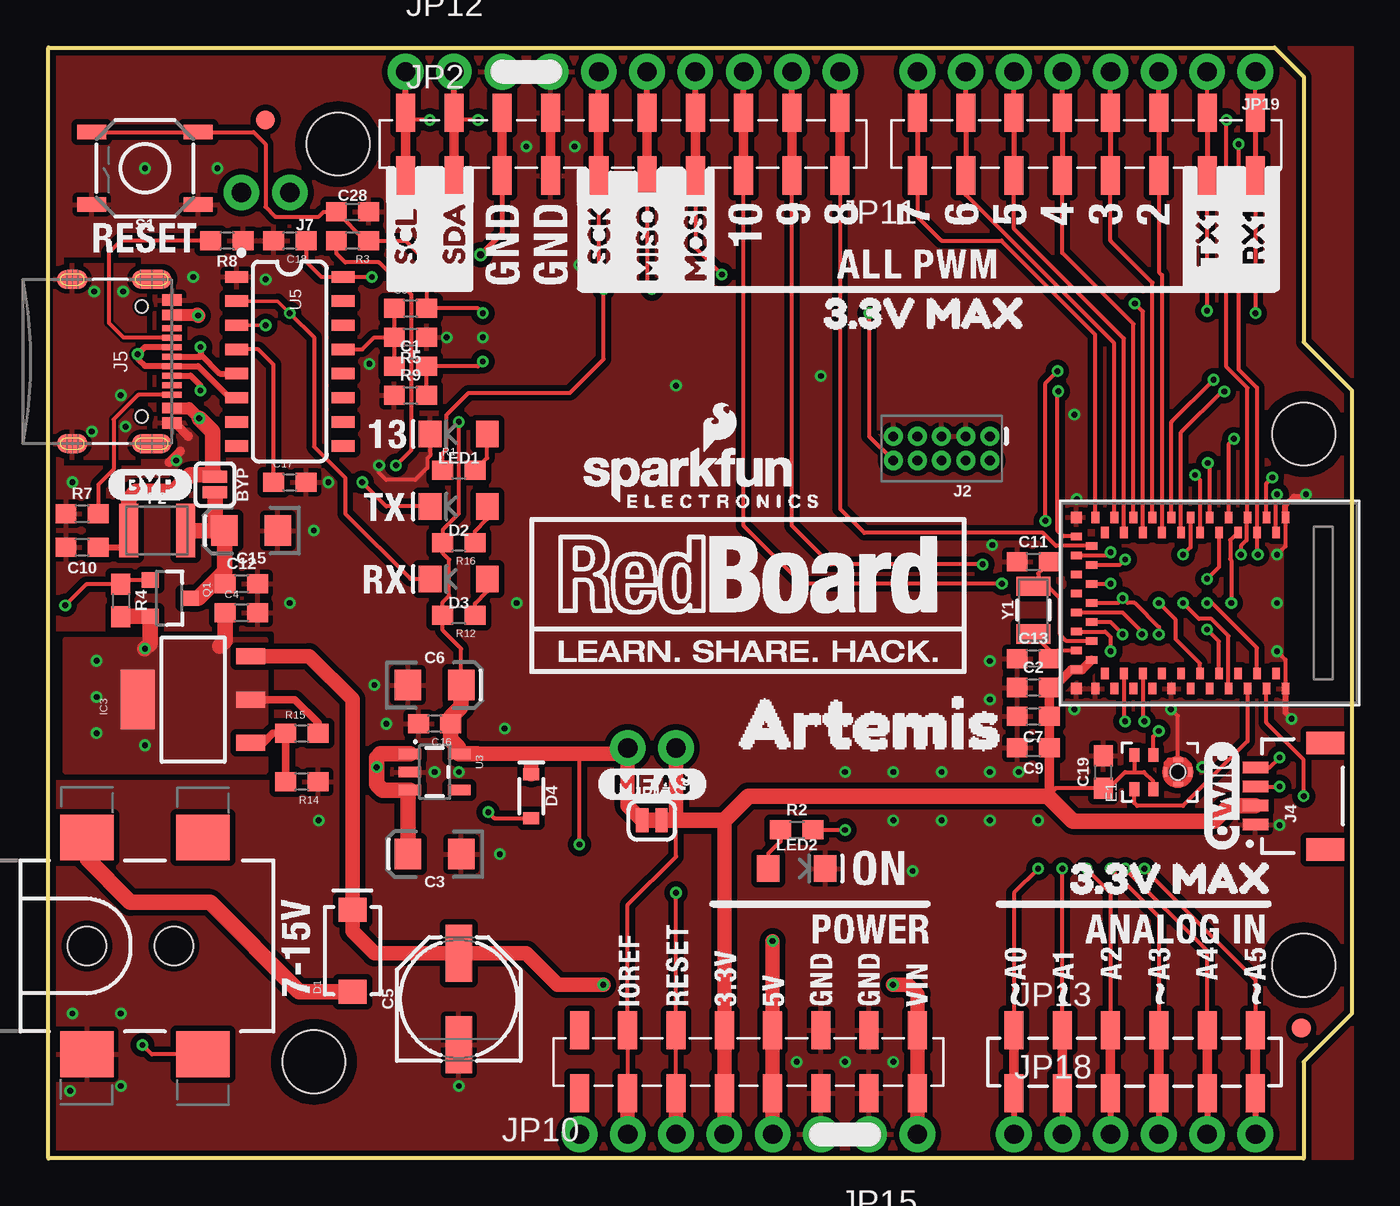
[diagram p1: board, top side]
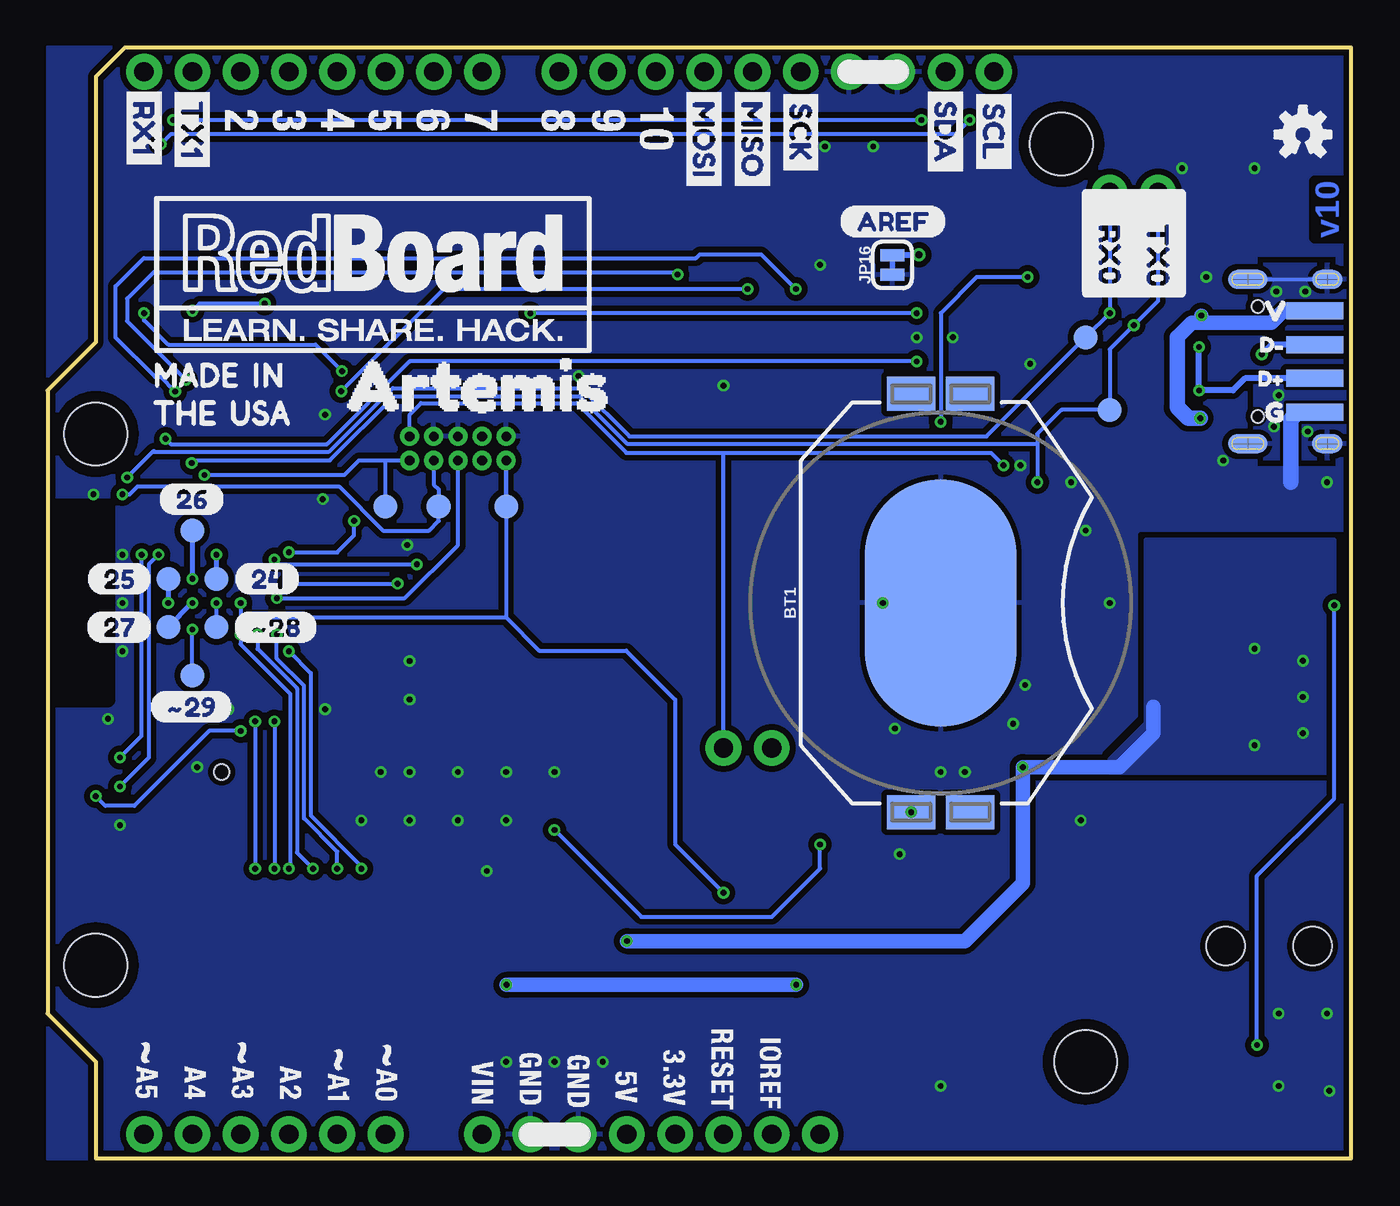
[diagram p2: board, bottom side, seen from below]

Size 68.58 x 58.42 mm. Coordinates in mm from the lower left corner, seen from the top.
Outline: 0,58.42 64.52,58.42 66.04,56.9 66.04,42.93 68.58,40.39 68.58,7.62 66.04,5.08 66.04,0 0,0 0,58.42
Copper layers (1*16): Top 0.035mm / dielectric 1.5mm / Bottom 0.035mm
Design rules "SparkFun-2-layer-PCBWay-LIMIT": minimum track width 6mil, minimum drill 0.3mm, track to track 6mil, track to pad 6mil, pad to pad 6mil, via to via 6mil, smd to smd 6mil, copper to edge 6mil, drill to drill 6mil, minimum pad ring 6mil, minimum via ring 6mil, stop-mask expansion 4mil, vias tented up to drill 25mil, thermal gap 10mil
tRestrict: area 65.4,24.1 to 68.6,34.3
bRestrict: area 65.4,24.1 to 68.6,34.3
vRestrict: area 0.6,22.4 to 2,30.6; area 5.7,23.1 to 7.4,30.6; area 47.9,10.8 to 48.5,11.3; area 50.4,10.7 to 50.9,11.6; area 11.3,29.3 to 12.7,31.6; area 0.3,13 to 9.4,25

### Footprints (pad centres in the part's own frame; a part is rotated, then mirrored left to right if it is on the bottom)
BATTCON_20MM_4LEGS_OVERPASTE = smd 1.778 x 2.54: 1 -11,1.55; 3 11,1.55; P$1 -11,-1.55; P$2 11,-1.55 | smd 13 x 8: 2 0,0
SMT-JUMPER_2_NO_SILK = smd 0.635 x 1.27: 1 -0.406,0; 2 0.406,0
0603 = smd 1.1 x 1: 1 -0.85,0; 2 0.85,0
EIA3216 = smd 1.4 x 1.6: + 1.4,0; - -1.4,0
PANASONIC_D = smd 3 x 1.4: + 2.4,0; - -2.4,0
SMA-DIODE = smd 1.27 x 1.47: A -2.15,0; C 2.15,0
LED-1206 = smd 1.2 x 1.4: A -1.5,0; C 1.5,0
SOD-323 = smd 0.63 x 0.83: A 1.15,0; C -1.15,0
SPH0641LM4H-1_MICROPHONE = smd 0.725 x 0.522: 1 -0.9,1.3; 2 -0.9,0.3; 4 0.9,0.3; 5 0.9,1.3 | smd 0.5 x 0.2: 3 0,-1.65; 8 0,-0.35 | smd 0.2 x 0.5: 6 -0.65,-1; 7 0.65,-1 | hole 0.8: 0,-1
1210 = smd 1 x 2.8: 1 -1.5,0; 2 1.5,0
SOT223-ALT1 = smd 0.838 x 1.524: 1 -2.271,-3.02; 2 0,-3.02; 3 2.288,-3.02 | smd 3.124 x 1.778: 4 0,2.921
1X02_NO_SILK = drill 1.016 pad 1.88: 1 0,0; 2 2.54,0
2X5-PTH-1.27MM-NO_SILK = drill 0.508 pad 1: 1 -2.54,-0.635; 2 -2.54,0.635; 3 -1.27,-0.635; 4 -1.27,0.635; 5 0,-0.635; 6 0,0.635; 7 1.27,-0.635; 8 1.27,0.635; 9 2.54,-0.635; 10 2.54,0.635
POWER_JACK_SMD_OVERPASTE_TOE = smd 2.8 x 2.4: GND 0,-5.7; P$4 6.1,-5.7; VIN0 0,5.7; VIN1 6.1,5.7 | hole 2.032: 0,0; 4.572,0
JST04_1MM_RA = smd 0.6 x 1.35: 1 -1.5,0; 2 -0.5,0; 3 0.5,0; 4 1.5,0 | smd 1.2 x 2: NC1 2.8,-3.675; NC2 -2.8,-3.675
USB-C-16P = smd 0.3 x 1.016: A5 -1.25,0.154; A6 -0.25,0.154; A7 0.25,0.154; A8 1.25,0.154; B5 1.75,0.154; B6 0.75,0.154; B7 -0.75,0.154; B8 -1.75,0.154 | smd 0.6 x 1.016: GND -3.225,0.154; GND2 3.225,0.154 | smd 1 x 2.1: SHLD1 -4.32,-0.915; SHLD2 4.32,-0.915 | smd 1 x 2.1 bottom: SHLD3 -4.32,-0.915; SHLD4 4.32,-0.915 | smd 1 x 1.6: SHLD5 -4.32,-5.095; SHLD8 4.32,-5.095 | smd 1 x 1.6 bottom: SHLD6 -4.32,-5.095; SHLD7 4.32,-5.095 | smd 0.55 x 1.016: VBUS1 -2.45,0.154; VBUS2 2.45,0.154 | hole 0.65: -2.89,-1.445; 2.89,-1.445
1X10_SMD_COMBINED = smd 1 x 2: 1A 0,1.65; 1B 0,-1.65; 2A 2.54,1.65; 2B 2.54,-1.65; 3A 5.08,1.65; 3B 5.08,-1.65; 4A 7.62,1.65; 4B 7.62,-1.65; 5A 10.16,1.65; 5B 10.16,-1.65; 6A 12.7,1.65; 6B 12.7,-1.65; 7A 15.24,1.65; 7B 15.24,-1.65; 8A 17.78,1.65; 8B 17.78,-1.65; 9A 20.32,1.65; 9B 20.32,-1.65; 10A 22.86,1.65; 10B 22.86,-1.65
STAND-OFF = hole 3.302: 0,0
FIDUCIAL-1X2 = smd 1 x 1: 1 0,0
1X08_SMD_COMBINED_NC = smd 1 x 2: 1 -17.78,1.65; 1@2 -17.78,-1.65; 2 -15.24,-1.65; 2@2 -15.24,1.65; 3 -12.7,1.65; 3@2 -12.7,-1.65; 4 -10.16,-1.65; 4@2 -10.16,1.65; 5 -7.62,1.65; 5@2 -7.62,-1.65; 6 -5.08,-1.65; 6@2 -5.08,1.65; 7 -2.54,1.65; 7@2 -2.54,-1.65; 8 0,-1.65; 8@2 0,1.65
1X10_NO_SILK = drill 1.016 pad 1.88: 1 0,0; 2 2.54,0; 3 5.08,0; 4 7.62,0; 5 10.16,0; 6 12.7,0; 7 15.24,0; 8 17.78,0; 9 20.32,0; 10 22.86,0
1X06_SMD_STRAIGHT_COMBO = smd 1 x 2: 1A 0,-1.65; 1B 0,1.65; 2A 2.54,1.65; 2B 2.54,-1.65; 3A 5.08,-1.65; 3B 5.08,1.65; 4A 7.62,1.65; 4B 7.62,-1.65; 5A 10.16,-1.65; 5B 10.16,1.65; 6A 12.7,1.65; 6B 12.7,-1.65
USB-SOLDER-PADS = smd 3 x 0.9: D+ 0,-0.889; D- 0,0.889; GND 0,-2.667; VBUS 0,2.667
1X08_NO_SILK@1 = drill 1.016 pad 1.88: 1 0,0; 2 2.54,0; 3 5.08,0; 4 7.62,0; 5 10.16,0; 6 12.7,0; 7 15.24,0; 8 17.78,0
SMT-JUMPER_2_NC_TRACE_SILK = smd 0.635 x 1.27: 1 -0.508,0; 2 0.508,0
1X06_NO_SILK@1 = drill 1.016 pad 1.88: 1 0,0; 2 2.54,0; 3 5.08,0; 4 7.62,0; 5 10.16,0; 6 12.7,0
1X08_NO_SILK = drill 1.016 pad 1.88: 1 0,0; 2 2.54,0; 3 5.08,0; 4 7.62,0; 5 10.16,0; 6 12.7,0; 7 15.24,0; 8 17.78,0
SOT23-3 = smd 0.8 x 0.9: 1 -0.95,-1; 2 0.95,-1; 3 0,1.1
TACTILE_SWITCH_SMD_5.2MM = smd 1.524 x 0.762: 1 -2.794,1.905; 2 2.794,1.905; 3 -2.794,-1.905; 4 2.794,-1.905
PAD.03X.05 = smd 1.27 x 1.27: P$1 0,0
ARTEMIS_FP = smd 0.4 x 0.6: AD16 -4,-3.7; BOOT 1.5,4.5; D0 0.5,-4.5; D1 -0.5,-4.5; D2 -1,-3.7; D3 2,-3.7; D7 -1.5,4.5; D8 -0.5,4.5; D9 2,3.7; D10 1,3.7; D14 -5,3.7; D17 -3.5,-4.5; D36 2.5,-4.5; D38 3,-3.7; D40 2.5,4.5; D41 -2.5,-4.5; GND@1 4.5,4.5; GND@39 -5.5,-4.5; GND@47 -1.5,-4.5; GND@59 4.5,-4.5; RXI-0 3.5,4.5; SWDCK 4,3.7; SWDIO 0,3.7; TXO-0 0.5,4.5; ~AD31 -3,-3.7; ~AD35 -2,3.7; ~D4 -2.5,4.5; ~D5 -1,3.7; ~D18 -4.5,-4.5; ~D19 -5,-3.7; ~D22 -3.5,4.5; ~D23 -4,3.7; ~D24 -3,3.7; ~D27 -4.5,4.5; ~D28 -5.5,4.5; ~D37 3.5,-4.5; ~D39 3,3.7; ~D42 1.5,-4.5; ~D43 1,-3.7; ~D44 4,-3.7; ~D45 -2,-3.7; ~RST 0,-3.7 | smd 0.6 x 0.4: AD34 -6.5,-0.5; D15 -6.5,0.5; VDD@36 -5.7,-3; VDD@37 -6.5,-3.5; XI -6.5,-2.5; XO -5.7,-2; ~AD11 -5.7,-1; ~AD12 -5.7,2; ~AD13 -5.7,1; ~AD29 -6.5,-1.5; ~AD32 -5.7,3; ~AD33/SWO -5.7,0; ~D6 -6.5,3.5; ~D25 -6.5,2.5; ~D26 -6.5,1.5 | smd 0.6 x 0.6: GND@22 -6.5,4.5; GND@38 -6.5,-4.5
SOT23-5 = smd 0.55 x 1.2: 1 -0.95,-1.3; 2 0,-1.3; 3 0.95,-1.3; 4 0.95,1.3; 5 -0.95,1.3
SO016 = smd 0.6 x 1.2: 1 -4.445,-2.8; 2 -3.175,-2.8; 3 -1.905,-2.8; 4 -0.635,-2.8; 5 0.635,-2.8; 6 1.905,-2.8; 7 3.175,-2.8; 8 4.445,-2.8; 9 4.445,2.8; 10 3.175,2.8; 11 1.905,2.8; 12 0.635,2.8; 13 -0.635,2.8; 14 -1.905,2.8; 15 -3.175,2.8; 16 -4.445,2.8
CRYSTAL-SMD-3.2X1.5MM = smd 1 x 1.8: P$1 -1.25,0; P$2 1.25,0

### Placement (x,y rotation side)
BT1  21.59,29.21 90 bottom
BYP  8.76,35.43 270 top
C1  19.05,41.66 0 top
C2  51.82,24.77 0 top
C3  20.32,16 180 top
C4  10.16,28.7 0 top
C5  21.59,8.38 90 top
C6  20.32,24.89 0 top
C7  51.82,23.24 180 top
C8  19.05,44.7 0 top
C9  51.82,21.59 180 top
C10  1.78,32.13 180 top
C11  51.82,31.37 0 top
C12  10.16,30.23 0 top
C13  51.82,26.29 0 top
C15  10.67,33.02 180 top
C16  20.32,22.86 180 top
C17  12.7,35.56 0 top
C18  12.7,48.26 180 top
C19  55.5,20.32 90 top
C28  16,49.78 0 top
D1  16,10.92 90 top
D2  21.59,34.29 180 top
D3  21.59,30.48 180 top
D4  25.4,19.05 270 top
E1  58.42,20.32 90 top
F2  5.71,33.02 0 top
FRAME2  FRAME-LETTERNO_PACKAGE  [DUMMY]  36.83,24.13 270 bottom
FRAME3  2.54,-7.62 0 top  (outside the outline)
IC3  7.62,24.13 90 top
J1  33.02,21.59 180 top
J2  46.99,37.34 180 top
J3  2.03,11.18 0 top
J4  63.5,19.05 90 top
J5  6.35,41.91 270 top
J7  12.7,50.8 180 top
JP1  33.66,35.94 0 top
JP2  18.8,53.34 0 top
JP3  13.97,5.08 0 top
JP4  66.04,10.16 0 top
JP5  66.04,38.1 0 top
JP6  15.24,53.34 0 top
JP7  35.31,38.48 0 top
JP8  65.91,6.86 0 top
JP9  11.43,54.61 0 top
JP10  27.94,5.08 180 top
JP11  45.72,53.34 180 top
JP12  18.8,57.15 0 top
JP13  50.8,5.08 0 top
JP14  1.91,41.91 0 bottom
JP15  45.72,1.27 180 top
JP16  24.13,46.99 90 bottom
JP17  31.75,17.78 0 top
JP18  50.8,1.27 0 top
JP19  63.5,57.15 180 top
LED1  21.59,38.1 180 top
LED2  39.37,15.24 0 top
Q1  6.35,29.46 270 top
R1  21.59,36.2 0 top
R2  39.37,17.27 0 top
R3  16,48.26 180 top
R4  3.81,29.34 270 top
R5  19.05,43.18 180 top
R7  1.78,33.91 0 top
R8  9.4,48.26 180 top
R9  19.05,40.13 0 top
R12  21.59,28.57 180 top
R14  13.34,19.81 180 top
R15  13.34,22.35 0 top
R16  21.59,32.38 180 top
S1  5.08,52.07 180 top
TP1  48.01,34.29 90 bottom
TP2  50.8,34.29 90 bottom
TP3  44.45,34.29 0 bottom
TP5  13.97,43.18 90 bottom
TP6  12.7,39.37 90 bottom
TP8  60.96,25.4 270 bottom
TP9  59.69,27.94 270 bottom
TP11  62.23,27.94 0 bottom
TP12  59.69,30.48 0 bottom
TP13  62.23,30.48 0 bottom
TP14  60.96,33.02 0 bottom
U1  60.58,29.21 0 top
U3  20.32,20.32 270 top
U5  12.7,41.91 270 top
U$1  [SCL1]  18.8,56.52 270 bottom
U$2  [D#3]  5.59,41.02 0 bottom
U$3  [SDA0]  21.34,56.64 270 bottom
U$4  [MADEINUSA#PNG]  59.44,40.13 0 bottom
U$9  [QWIIC_COPYRIGHT_SMALL]  61.72,19.05 90 top
U$10  [D#4]  5.46,42.8 0 bottom
U$11  [G1]  5.46,39.24 0 bottom
U$12  [V0]  5.46,44.58 0 bottom
U$13  [3#3V_MAX2]  52.32,14.73 0 top
U$14  [ARTEMIS0]  34.04,22.86 0 top
U$15  [ARTEMIS0]  55.12,40.64 0 bottom
U$16  2.54,53.85 0 bottom
U$17  [#284]  58.8,27.94 0 bottom
U$18  [SCL1]  18.8,45.97 90 top
U$19  [#295]  63.25,23.75 0 bottom
U$20  [AREF2]  26.92,49.28 0 bottom
U$21  [240]  58.8,30.48 0 bottom
U$22  [SDA0]  21.34,45.97 90 top
U$23  [251]  66.55,30.48 0 bottom
U$24  [262]  62.74,34.67 0 bottom
U$25  [273]  66.55,27.94 0 bottom
U$26  [SCK9]  28.96,56.52 270 bottom
U$27  [MISO8]  31.5,56.64 270 bottom
U$28  [MOSI7]  34.04,56.64 270 bottom
U$29  [TX10]  60.96,56.64 270 bottom
U$30  [RX11]  63.5,56.64 270 bottom
U$47  [MISO8]  31.5,45.09 90 top
U$48  [MOSI7]  34.04,45.09 90 top
U$49  [RX01]  12.7,50.16 270 bottom
U$50  [SCK9]  28.96,45.97 90 top
U$53  [TX00]  10.16,50.16 270 bottom
U$67  [3#3V_MAX2]  39.37,44.45 0 top
U$68  [BYP0]  3.05,35.43 0 top
U$70  [MEAS3]  28.83,19.68 0 top
U$71  [RX11]  63.37,45.97 90 top
U$72  [TX10]  60.96,45.85 90 top
Y1  51.82,28.83 90 top

### Tracks (layer width: path | path; a pad name or v marks a point on that pad's centre or on a via)
3.3V  (via drill 0.3)
  Top 0.203: v17.02,46.35 U5.16 14.35,46.35 13.55,47.16 C18.1 | C6.+ 21.72,26.79 20.74,27.77 R12.2 20.74,29.25 21.08,29.59 21.08,31.5 20.74,31.84 R16.2 20.74,33.06 21.59,33.91 v21.59,38.73 | R2.2 v41.91,17.27 | JP17.1 30.99,17.78 | v27.94,16.51 27.94,21.14 27.81,21.27
  Top 0.508: 21.59,21.3 U3.5
  Top 0.762: 22.55,21.27 25.4,21.27 | D4.C 25.4,21.27 | J1.2 30.48,21.08 | JP17.1 30.48,18.54 J1.2 | 25.4,21.27 27.81,21.27 30.16,21.27 J1.2
  Top 0.813: C6.+ 21.72,23.75 21.17,23.2 C16.1 21.17,22.01 21.59,21.59 21.59,21.3 | U3.5 22.55,21.27
  Bottom 0.203: v17.02,46.35 19.68,46.35 21.59,44.45 v21.59,38.73 | v41.91,17.27 37.34,12.7 30.48,12.7 27.94,15.24 v27.94,16.51
5V  (via drill 0.3)
  Top 0.406: IC3.2 12.95,24.13 14.19,22.9 R15.2
  Top 0.508: 18.92,19.27 U3.3
  Top 0.762: v38.1,11.43 JP10.4 JP10.4@2 JP15.4
  Top 0.813: C3.+ 18.92,19.27 | v5.08,26.81 5.35,27.08 Q1.2 3.84,28.51 R4.2 | U3.3 17.59,19.37 17.27,19.68 v17.27,20.57 17.27,21.08 17.46,21.27 U3.1 | C4.1 9.31,27.22 9.02,26.92
  Bottom 0.762: v38.1,11.43 20.32,11.43 17.27,14.48 v17.27,20.57 12.19,20.57 10.41,22.35 10.41,23.75
  other vias: 2.54,24.27 5.08,21.73 2.54,22.36 2.54,26.17
  pour Bottom (isolate 0.305, no thermals): 0.89,32.51 10.79,32.51 10.79,22.86 12.7,20.95 12.7,20.32 0.89,20.32
  pour Top (isolate 0.305, no thermals): 0.89,20.32 0.89,27.3 11.43,27.3 11.43,20.32
!DTR
  Top 0.203: R5.2 C1.1 | U5.13 16.51,42.55 17.14,43.18 R5.2 | C8.1 R5.2
!RESET  (via drill 0.3)
  Top 0.203: JP10.6@2 JP10.6 v33.02,13.97 | S1.4 S1.3 10.79,53.98 11.43,53.34 11.43,50.04 11.94,49.53 14.22,49.53 14.48,49.78 C28.1 16.68,48.26 R3.1 18.8,48.26 19.9,47.16 C8.2 22.61,44.7 v22.86,44.45 | v43.18,44.45 43.18,37.97 J2.10 | U1.~RST 60.58,26.04 59.31,27.3 59.31,28.32 v58.42,29.21
  Top 0.762: JP10.6@2 JP15.6
  Bottom 0.203: v22.86,44.45 v43.18,44.45 | v33.02,13.97 35.56,16.51 35.56,24.13 38.14,26.71 42.71,26.71 44.45,28.45 | 44.45,28.45 J2.10 TP3.P$1 | 44.45,28.45 58.42,28.45 v58.42,29.21
BOOT  (via drill 0.3)
  Top 0.203: R9.2 C1.2 22.61,41.66 v22.86,41.91 | v62.37,37.85 62.08,37.55 U1.BOOT
  Bottom 0.203: v62.37,37.85 62.09,37.57 53.87,37.57 49.53,41.91 v22.86,41.91
CC1
  Top 0.203: J5.A5 3.96,43.16 3.17,43.94 3.17,47.62 3.81,48.26 R8.2
CC2
  Top 0.203: J5.B5 4.73,40.16 3.43,38.86 3.43,36.23 2.63,35.43 R7.2
D14/SDA  (via drill 0.3)
  Top 0.203: v61.98,54.61 61.98,41.63 63.08,40.53 U1.D40 63.03,33.66 63.03,32.51 62.74,32.21 v62.74,31.75 | J4.3 v64.77,19.56 | JP2.2A 21.34,54.48 | 21.34,54.48 JP2.2B | v22.61,54.61 21.46,54.61 21.34,54.48
  Top 0.305: JP2.2A JP12.2
  Bottom 0.203: v61.98,54.61 v22.61,54.61 | v62.74,31.75 63.25,31.24 63.25,21.08 v64.77,19.56
D18/A2  (via drill 0.3)
  Top 0.203: U1.AD34 56.51,28.71 57.53,27.69 v57.53,27.56 | JP13.3A JP13.3B 55.88,13.97 v54.61,15.24
  Top 0.305: JP13.3A JP18.3
  Bottom 0.203: v57.53,27.56 57.53,26.8 55.45,24.72 55.45,16.08 v54.61,15.24
D20/A4  (via drill 0.3)
  Top 0.203: JP13.5A JP13.5B 60.96,10.92 v56.64,15.24 | U1.AD16 56.58,23.05 v56.64,22.99
  Top 0.305: JP13.5A JP18.5
  Bottom 0.203: v56.64,22.99 v56.64,15.24
D24  (via drill 0.3)
  Top 0.203: U1.D8 60.08,32.14 v59.69,31.75
  Bottom 0.254: TP12.P$1 v59.69,31.75
D25  (via drill 0.3)
  Top 0.203: v62.23,29.21 62.23,31.47 62.18,31.52 62.18,32.51 U1.D9
  Bottom 0.254: TP13.P$1 v62.23,29.21
D26  (via drill 0.3)
  Top 0.203: U1.D10 61.58,31.1 v60.96,30.48
  Bottom 0.254: TP14.P$1 v60.96,30.48
D27  (via drill 0.3)
  Top 0.203: U1.D38 63.58,26.84 61.21,29.21 v60.96,29.21
  Bottom 0.254: TP11.P$1 v60.96,29.21
D+  (via drill 0.3)
  Top 0.305: J5.A6 8.01,42.16 8.01,42.29 | 8.01,42.29 9.02,41.27 U5.5 | J5.B6 7.48,41.16 8,40.64 v8,40.39 | v8,42.67 v8.01,42.67 8.01,42.29
  Bottom 0.305: v8,42.67 v8,40.39 6.22,40.39 5.59,41.02 JP14.D+
D-  (via drill 0.3)
  Top 0.305: J5.B7 5.07,42.66 v4.7,42.29 v4.71,42.28 4.71,42.04 5.08,41.66 J5.A7 7.87,41.66 9.53,40.01 U5.6
  Bottom 0.305: JP14.D- 4.19,42.8 v4.7,42.29
GND  (via drill 0.3)
  Top 0.203: E1.7 58.94,20.97 58.77,20.79 E1.8 | E1.7 59.42,23.26 v59.05,23.62 | E1.3 60.07,20.7 59.8,20.97 E1.7 | E1.6 59.07,19.67 58.77,19.97 E1.8 | U1.GND@1 65.08,32.19 v64.64,31.75 | v64.64,26.67 65.08,26.23 U1.GND@59 | E1.8 | LED1.C 20.09,36.95 19.94,36.8 19.94,36.32 19.3,35.69 17.78,35.69 17.4,36.07 v17.4,36.45
  Top 0.305: U1.GND@1 65.08,34.34 65.53,34.8 66.04,34.8 v66.17,34.92 | U1.GND@59 65.08,23.44 v65.41,23.11
  Top 0.508: 6.94,37.19 6.35,36.6 | 6.65,38.69 7.37,37.97
  Bottom 0.813: JP14.GND 2.79,39.24 3.17,38.86 3.17,35.56
  other vias: 5.08,52.07 41.91,5.08 27.69,53.21 1.27,7.62 27.94,46.99 17.78,22.86 14.22,17.78 6.73,36.7 13.97,33.02 14.73,35.56 12.7,29.21 11.43,46.23 8.89,52.07 23.75,16 7.62,46.35 1.27,35.56 20.32,20.32 21.59,20.32 24,22.61 17.14,24.89 3.81,3.81 3.81,7.62 1.14,3.56 21.59,3.81 44.45,5.08 39.37,5.08 16.89,41.78 22.86,43.18 20.95,43.18 64.77,17.53 45.47,15.11 25.15,53.21 24.64,29.21 33.02,40.64 40.64,41.15 44.45,20.32 49.53,26.16 53.98,23.62 64.64,29.21 53.98,39.12 54.1,34.67 51.05,20.32 49.53,24.13 49.53,20.32 49.66,32.26 60.71,20.57 44.45,17.78 46.99,17.78 49.53,17.78 52.07,17.78 46.99,20.32 41.91,20.32
  pour Top (isolate 0.305, rank 2): 0,58.42 68.58,58.42 68.58,0 0,0
  pour Bottom (isolate 0.305, rank 2): 0,58.42 68.58,58.42 68.58,0 0,0
INSERT  (via drill 0.3)
  Top 0.203: J3.P$4 5.45,5.48 v4.95,5.97 | R4.1 1.99,30.19 v0.89,29.08 | Q1.1 4.04,30.41
  Top 0.305: 4.04,30.41 R4.1
  Bottom 0.203: v4.95,5.97 4.95,14.86 0.89,18.92 v0.89,29.08
N$1
  Top 0.203: R1.2 23.09,36.84 LED1.A
N$2
  Top 0.203: R2.1 38.52,16.68 37.87,16.03 LED2.A
N$4
  Top 0.813: 31.37,17.78 32.13,17.78
N$5
  Top 0.203: R16.1 22.44,32.98 23.09,33.63 D2.A
N$6
  Top 0.203: U5.4 11.05,42.55 11.85,41.74 C17.1
N$7
  Top 0.203: U1.XO 53.56,27.21 53.21,27.56 53.21,29.46 52.58,30.1 52.07,30.1 | 52.07,30.1 51.84,30.1 Y1.P$2 | C11.2 52.07,30.77 52.07,30.1
N$8
  Top 0.203: U1.XI 53.09,26.71 C13.2 52.67,26.73 Y1.P$1
N$9
  Top 0.203: R12.1 22.44,29.17 23.09,29.82 D3.A
N$10  (via drill 0.38)
  Top 0.254: JP2.3B 23.88,48.67 v22.73,47.52
  Top 0.381: JP2.3A JP2.3B
  Bottom 0.305: JP16.2 24.11,47.52 v22.73,47.52
N$15
  Top 0.406: IC3.1 11.32,21.86 11.81,22.35 R15.1 R14.2
PDMCLK  (via drill 0.3)
  Top 0.203: E1.4 58.12,22.18 v58.42,22.48 | v66.04,19.05 66.04,20.95 64.08,22.92 U1.~D37
  Bottom 0.203: v58.42,22.48 60.07,22.48 64.01,18.54 65.53,18.54 v66.04,19.05
PDMDATA
  Top 0.203: U1.D36 63.08,21.93 59.69,18.54 57.28,18.54 57.12,18.7 E1.1
PWRIN
  Top 0.813: J3.VIN0 2.03,15.75 4.32,13.46 8.51,13.46 13.2,8.77 D1.A
RXI-0  (via drill 0.3)
  Top 0.178: U5.2 12.06,45.09 v12.7,44.45
  Top 0.203: v12.7,44.45 TP5.P$1 13.97,37.44 15.62,35.78 15.62,33.91 19.05,30.48 D3.C | U1.RXI-0 64.08,35.5 v64.39,35.81
  Bottom 0.203: v64.39,35.81 62.99,37.21 62.99,37.17 53.76,37.17 50.42,40.51 40.51,40.51 37.97,37.97 19.18,37.97 TP5.P$1 v12.7,44.45 J7.1
SHLD  (via drill 0.3)
  Bottom 0.203: J5.SHLD1 J5.SHLD5
  other vias: 2.41,45.59 3.94,45.59 3.81,40.13 4.06,38.48 2.29,38.23
  pour Bottom: 0,46.99 5.08,46.99 5.08,36.83 0,36.83
  pour Top: 0,46.99 5.08,46.99 5.08,36.83 0,36.83
SWDCK  (via drill 0.3)
  Top 0.203: U1.SWDCK 64.58,34.86 v64.64,34.92
  Bottom 0.203: J2.4 48.26,35.43 48.01,35.18 TP1.P$1 48.01,33.53 48.51,33.02 50.93,33.02 53.25,35.34 63.84,35.34 64.26,34.92 v64.64,34.92
SWDIO  (via drill 0.3)
  Top 0.203: v60.33,35.94 60.58,35.69 U1.SWDIO
  Bottom 0.203: v60.33,35.94 52.96,35.94 52.2,36.7 50.8,36.7 | 50.8,36.7 J2.2 | TP2.P$1 50.8,36.7
TXO-0  (via drill 0.3)
  Top 0.178: U5.3 v11.43,43.81
  Top 0.203: D2.C 17.78,34.29 v16.51,35.56 | v61,36.58 61.08,36.49 U1.TXO-0
  Bottom 0.203: 16.51,37.59 v16.51,35.56 | v61,36.58 60.87,36.7 53.73,36.7 50.36,40.07 40.58,40.07 38.1,37.59 16.51,37.59 | 16.51,37.59 16.51,38.1 15.24,39.37 TP6.P$1 12.7,42.55 v11.43,43.81 10.16,45.09 J7.2
USBVCC
  Top 0.254: BYP.2 8.76,34.82
  Top 0.813: F2.2 C15.+ | C15.+ 8.76,33.52 8.76,34.82 | Q1.3 7.87,29.46 8.64,30.23 | 8.64,30.23 C12.1 | C15.+ 9.27,30.86 8.64,30.23
V_BATT  (via drill 0.3)
  Top 0.203: BT1.1 23.45,17.9 D4.A
  other vias: 23.14,18.21
VDD  (via drill 0.3)
  Top 0.203: v18.29,36.45 19.1,37.26 19.1,45.42 17.4,47.12 15.62,47.12 15.15,47.59 R3.2 | JP10.7 JP10.7@2 30.48,13.34 33.02,15.88 33.02,17.78 | E1.2 58.12,19.84 57.64,20.32 57.15,20.32 | 52.58,19.05 53,19.47 C19.1 55.79,19.47 56.64,20.32 57.15,20.32 | 57.15,20.32 57.12,20.35 E1.5
  Top 0.508: 52.58,19.05 52.67,19.14 C9.1 C7.1 C2.2 52.88,24.77 53.82,25.71 U1.VDD@37 54.38,25.71 U1.VDD@36
  Top 0.762: J1.1 33.02,17.78 | JP15.5 JP10.5 JP10.5@2 35.56,17.78 | JP10.7 JP15.7
  Top 0.813: JP17.2 33.02,17.78 35.56,17.78 36.83,19.05 52.58,19.05 53.89,17.74 61.3,17.74 62.11,18.55 J4.2
  Bottom 0.203: J2.1 49.53,39.12 48.93,39.72 40.73,39.72 38.12,37.11 33.02,37.11 | J1.1 33.02,37.11 | 33.02,37.11 18.95,37.11 v18.29,36.45
VIN  (via drill 0.3)
  Top 0.762: IC3.3 13.72,26.42 16,24.14 D1.C 16,11.94 17.16,10.78 C5.+ 25.14,10.78 26.79,9.13 v29.2,9.13 | v44.44,9.13 45.2,9.13 45.21,9.14 45.72,8.64 JP10.1@2 JP10.1 JP15.1
  Bottom 0.762: v29.2,9.13 v44.44,9.13
VUSB  (via drill 0.3)
  Top 0.254: 8.76,35.94 BYP.1 8.64,35.97
  Top 0.305: C10.1 3.94,32.13 3.94,32.74 F2.1
  Top 0.635: J5.VBUS2 7.4,39.46 v7.94,38.92 | J5.VBUS1 7.84,44.36
  Top 0.762: 7.84,44.36 v7.87,44.32
  Top 0.813: F2.1 4.21,34.7 4.61,35.09 6.6,35.09 7.46,35.94 8.76,35.94 | v7.94,38.92 8.64,38.23 8.64,35.97
  Bottom 0.762: JP14.VBUS 3.56,44.58 4.19,43.94 7.87,43.94 | 9.14,43.18 8.38,43.94 7.87,43.94 | v7.87,44.32 7.87,43.94
  Bottom 0.813: 9.14,43.18 9.14,39.5 8.57,38.92 v7.94,38.92
~D0/RXI-1  (via drill 0.3)
  Top 0.203: JP11.1 v63.5,44.45 | v53.09,41.4 52.45,40.77 v52.45,33.53 | U1.~D25 55.71,31.71 v55.88,31.88 | JP11.1@2 JP19.1
  Top 0.254: JP11.1@2 JP11.1
  Bottom 0.203: v53.09,41.4 54.48,42.8 62.23,42.8 63.5,44.07 v63.5,44.45 | v55.88,31.88 53.34,31.88 52.45,32.77 v52.45,33.53
~D1/TXO-1  (via drill 0.3)
  Top 0.203: v60.96,44.58 JP11.2@2 | U1.~D24 57.58,44.53 v57.15,44.96 | JP11.2 JP19.2
  Top 0.254: JP11.2 JP11.2@2
  Bottom 0.203: v57.15,44.96 60.58,44.96 v60.96,44.58
~D2/A6
  Top 0.203: U1.~AD35 58.58,46.45 58.42,46.61 JP11.3
  Top 0.254: JP19.3 JP11.3@2 JP11.3
~D3
  Top 0.203: JP11.4@2 55.88,48.26 58.08,46.06 U1.~D4
  Top 0.254: JP19.4 JP11.4 JP11.4@2
~D4
  Top 0.203: JP11.5 53.34,47.62 57.08,43.89 U1.~D22
  Top 0.254: JP19.5 JP11.5@2 JP11.5
~D5
  Top 0.203: JP11.6@2 50.8,48.9 56.58,43.12 U1.~D23
  Top 0.254: JP19.6 JP11.6 JP11.6@2
~D6
  Top 0.203: U1.~D27 56.08,42.86 48.9,50.04 48.26,50.67 JP11.7
  Top 0.254: JP19.7 JP11.7@2 JP11.7
~D7
  Top 0.203: U1.~D28 55.08,43.32 50.14,48.26 46.99,48.26 45.72,49.53 JP11.8@2
  Top 0.254: JP19.8 JP11.8 JP11.8@2
~D8/A8
  Top 0.203: JP2.10A JP2.10B 41.66,34.16 42.93,32.89 52.32,32.89 53.01,32.21 U1.~AD32
  Top 0.305: JP2.10A JP12.10
~D9/A9  (via drill 0.3)
  Top 0.203: JP2.9A JP2.9B 39.12,33.27 41.15,31.24 v49.15,31.24 | U1.~AD12 56.36,31.21 v56.64,31.5
  Top 0.305: JP2.9A JP12.9
  Bottom 0.203: v56.64,31.5 56.39,31.24 v49.15,31.24
~D10/A10  (via drill 0.3)
  Top 0.203: JP2.8A JP2.8B 36.58,33.27 39.64,30.21 39.66,30.23 v50.16,30.23 | U1.~AD13 55.86,30.21 v55.88,30.23
  Top 0.305: JP2.8A JP12.8
  Bottom 0.203: v55.88,30.23 v50.16,30.23
~D11/MOSI  (via drill 0.3)
  Top 0.203: JP2.7A JP2.7B 34.04,47.88 v35.43,46.48 | v61.3,40.95 59.08,38.73 U1.D7
  Top 0.305: JP2.7A JP12.7
  Bottom 0.203: v61.3,40.95 64.39,44.04 64.39,45.21 62.99,46.61 35.56,46.61 v35.43,46.48
~D12/MISO  (via drill 0.3)
  Top 0.203: JP2.6A JP2.6B 31.5,45.97 v31.75,45.72 | U1.~D6 53.4,32.71 53.09,33.02 53.09,40.13 53.13,40.17 v53.13,40.34
  Top 0.305: JP2.6A JP12.6
  Bottom 0.203: v53.13,40.34 47.75,45.72 v31.75,45.72
~D13/SCK  (via drill 0.3)
  Top 0.203: JP2.5B 28.96,45.97 v29.21,45.72 29.21,42.04 27.43,40.26 22.1,40.26 20.94,39.1 20.94,37.3 20.74,37.09 R1.1 | v61.86,40.33 61.73,40.33 59.58,38.18 U1.~D5
  Top 0.254: JP2.5B JP2.5A
  Top 0.305: JP2.5A JP12.5
  Bottom 0.203: v61.86,40.33 62.63,41.1 62.93,41.1 65,43.17 65,45.87 63.52,47.35 34.47,47.35 34.27,47.55 31.04,47.55 v29.21,45.72
~D15/SCL  (via drill 0.3)
  Top 0.203: v62.61,53.34 62.61,41.5 63.58,40.53 U1.~D39 63.58,31.8 v63.63,31.75 | J4.4 64.24,20.55 v64.77,21.08 | v20.07,54.61 19.18,54.61 JP2.1A JP2.1B
  Top 0.305: JP2.1A JP12.1
  Bottom 0.203: v20.07,54.61 20.83,53.85 62.1,53.85 v62.61,53.34 | v64.77,21.08 63.63,22.23 v63.63,31.75
~D16/A0  (via drill 0.3)
  Top 0.203: U1.~AD29 55.6,27.71 55.88,27.43 v55.88,26.67 | JP13.1A JP13.1B 50.8,13.97 v52.07,15.24
  Top 0.305: JP13.1A JP18.1
  Bottom 0.203: v55.88,26.67 54.74,25.53 54.74,18.03 52.07,15.37 v52.07,15.24
~D17/A1  (via drill 0.3)
  Top 0.203: U1.~AD11 55.86,28.21 v56.52,27.56 | JP13.2B JP13.2A v53.34,15.24
  Top 0.305: JP13.2B JP18.2
  Bottom 0.203: v53.34,15.24 53.34,16.13 55.09,17.89 55.09,24.87 56.52,26.29 v56.52,27.56
~D19/A3  (via drill 0.3)
  Top 0.203: U1.~AD33/SWO 56.28,29.21 v56.52,29.45 v56.52,29.46 56.77,29.21 57.15,29.21 58.42,27.94 v58.42,27.56 | JP13.4B JP13.4A 58.42,12.7 56.44,14.68 56.41,14.68 56.08,15.01 56.08,15.04 v55.88,15.24
  Top 0.305: JP13.4B JP18.4
  Bottom 0.203: J2.6 46.99,32.26 49.78,29.46 v56.52,29.46 | v58.42,27.56 58.42,27.05 55.8,24.43 55.8,15.32 v55.88,15.24
~D21/A5  (via drill 0.3)
  Top 0.203: JP13.6B JP13.6A 63.5,9.4 v57.66,15.24 | U1.~AD31 57.58,23.07 v57.66,22.99
  Top 0.305: JP13.6B JP18.6
  Bottom 0.203: v57.66,22.99 v57.66,15.24
~D28  (via drill 0.3)
  Top 0.203: v59.69,29.21 60.53,28.37 61.19,28.37 62.08,27.48 U1.~D42
  Bottom 0.203: TP9.P$1 v59.69,29.21
~D29  (via drill 0.3)
  Top 0.203: U1.~D43 61.58,27.19 v60.96,27.81
  Bottom 0.203: TP8.P$1 v60.96,27.81

### Text on the board
Bottom: v10
Measures: Units in inches
tDocu: N. Seidle
214bmp: D:/SmartProjects/Snc/a4_bn_logo2.bmp